# Altium project LiFePO4 Fuel Gauge.PrjPcb
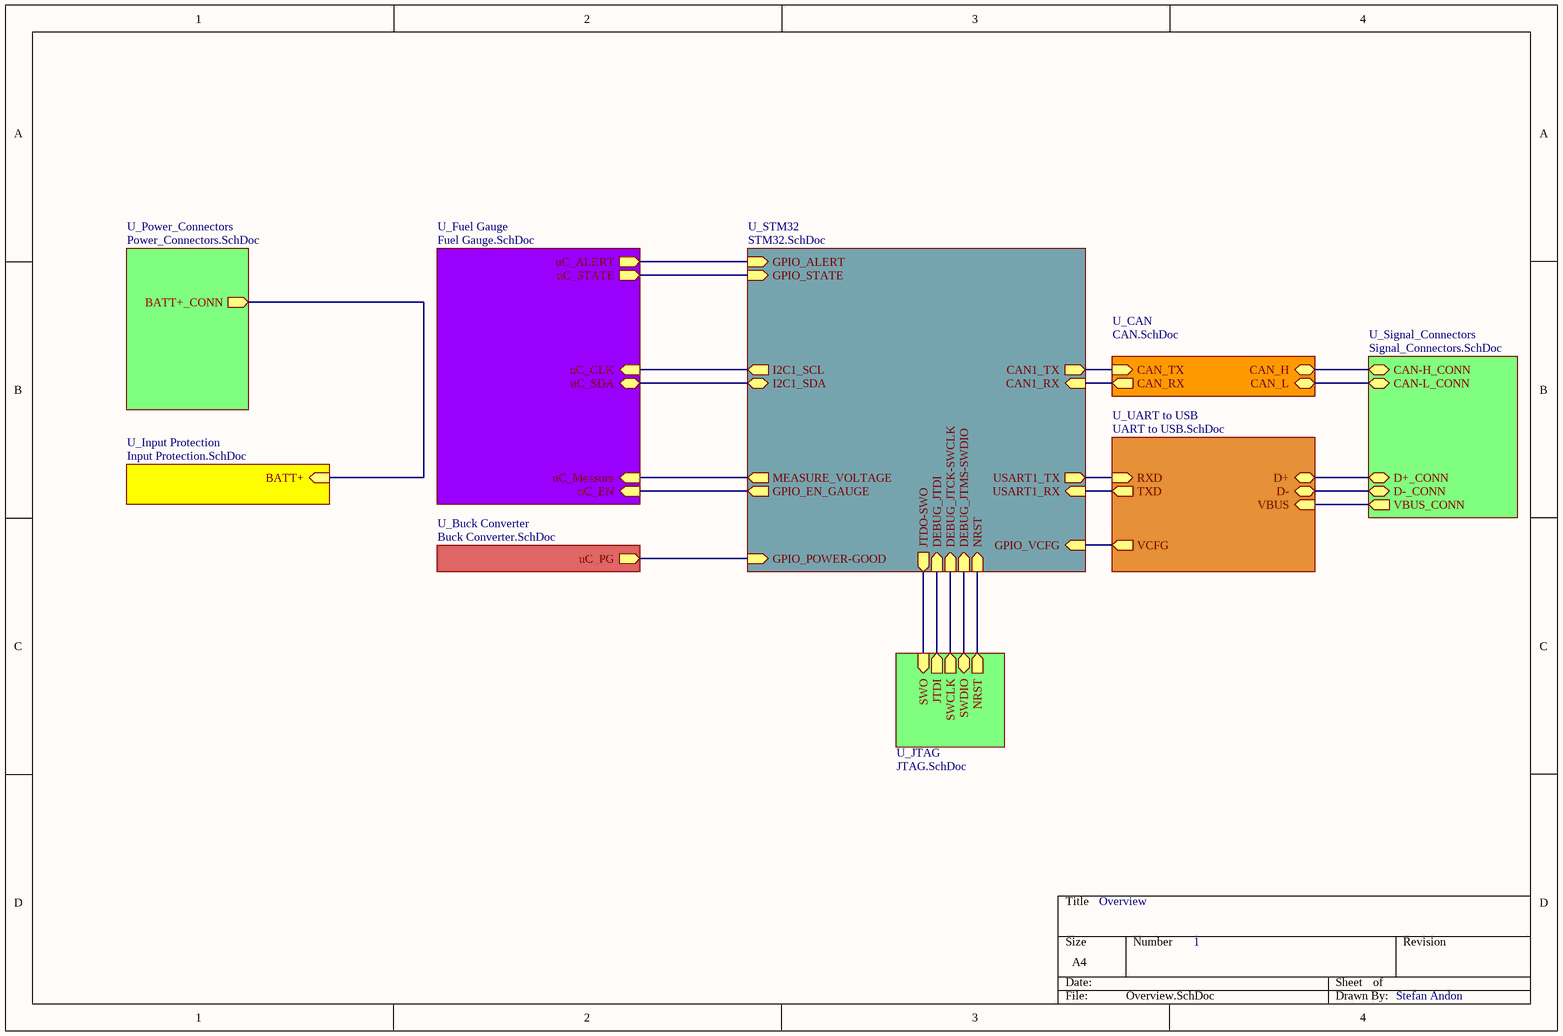
[diagram p0: Overview.SchDoc]
10 sheets, 119 parts. Net scope: hierarchical (ports join the sheet entries above them; power ports are global).
Board file: LiFePO4 Fuel Gauge.PcbDoc
Sheets:
  Overview.SchDoc
    U_Fuel Gauge = Fuel Gauge.SchDoc
    U_Buck Converter = Buck Converter.SchDoc
    U_Input Protection = Input Protection.SchDoc
    U_STM32 = STM32.SchDoc
    U_CAN = CAN.SchDoc
    U_UART to USB = UART to USB.SchDoc
    U_JTAG = JTAG.SchDoc
    U_Power_Connectors = Power_Connectors.SchDoc
    U_Signal_Connectors = Signal_Connectors.SchDoc

## Sheet Overview.SchDoc
size A4; SheetNumber: 1; SheetTotal: 10

### Sub-sheets
U_Buck Converter = Buck Converter.SchDoc: uC_PG (out)
U_CAN = CAN.SchDoc: CAN_TX (in), CAN_RX (out), CAN_H (bidir), CAN_L (bidir)
U_Fuel Gauge = Fuel Gauge.SchDoc: uC_ALERT (out), uC_STATE (out), uC_EN (in), uC_Measure (in), uC_SDA (bidir), uC_CLK (in)
U_Input Protection = Input Protection.SchDoc: BATT+ (in)
U_JTAG = JTAG.SchDoc: SWDIO (bidir), SWCLK (out), SWO (in), JTDI (out), NRST (out)
U_Power_Connectors = Power_Connectors.SchDoc: BATT+_CONN (out)
U_Signal_Connectors = Signal_Connectors.SchDoc: CAN-H_CONN (bidir), CAN-L_CONN (bidir), VBUS_CONN (out), D+_CONN (bidir), D-_CONN (bidir)
U_STM32 = STM32.SchDoc: I2C1_SDA (bidir), I2C1_SCL (out), CAN1_RX (in), CAN1_TX (out), JTDO-SWO (out), DEBUG_JTDI (in), DEBUG_JTCK-SWCLK (in), DEBUG_JTMS-SWDIO (in), NRST (in), USART1_RX (in), USART1_TX (out), GPIO_ALERT (in), GPIO_STATE (in), GPIO_EN_GAUGE (out), MEASURE_VOLTAGE (out), GPIO_POWER-GOOD (in), GPIO_VCFG (in)
U_UART to USB = UART to USB.SchDoc: D+ (bidir), D- (bidir), VCFG (out), TXD (out), RXD (in), VBUS (in)

### Nets
ALERT: sheet U_Fuel Gauge/uC_ALERT, sheet U_STM32/GPIO_ALERT
CAN-H: sheet U_CAN/CAN_H, sheet U_Signal_Connectors/CAN-H_CONN
CAN-L: sheet U_CAN/CAN_L, sheet U_Signal_Connectors/CAN-L_CONN
D+: sheet U_UART to USB/D+, sheet U_Signal_Connectors/D+_CONN
D-: sheet U_UART to USB/D-, sheet U_Signal_Connectors/D-_CONN
PG1: sheet U_Buck Converter/uC_PG, sheet U_STM32/GPIO_POWER-GOOD
STATE: sheet U_Fuel Gauge/uC_STATE, sheet U_STM32/GPIO_STATE
VIN: sheet U_Input Protection/BATT+, sheet U_Power_Connectors/BATT+_CONN
NetC30_1: sheet U_STM32/NRST, sheet U_JTAG/NRST
NetIC1_1: sheet U_Fuel Gauge/uC_EN, sheet U_STM32/GPIO_EN_GAUGE
NetIC1_3: sheet U_Fuel Gauge/uC_Measure, sheet U_STM32/MEASURE_VOLTAGE
NetIC6_26: sheet U_STM32/GPIO_VCFG, sheet U_UART to USB/VCFG
NetIC7_1: sheet U_STM32/CAN1_TX, sheet U_CAN/CAN_TX
NetIC7_4: sheet U_STM32/CAN1_RX, sheet U_CAN/CAN_RX
NetIC9_30: sheet U_Fuel Gauge/uC_CLK, sheet U_STM32/I2C1_SCL
NetIC9_31: sheet U_Fuel Gauge/uC_SDA, sheet U_STM32/I2C1_SDA
NetIC9_34: sheet U_STM32/DEBUG_JTMS-SWDIO, sheet U_JTAG/SWDIO
NetIC9_37: sheet U_STM32/DEBUG_JTCK-SWCLK, sheet U_JTAG/SWCLK
NetIC9_38: sheet U_STM32/DEBUG_JTDI, sheet U_JTAG/JTDI
NetIC9_39: sheet U_STM32/JTDO-SWO, sheet U_JTAG/SWO
NetIC9_42: sheet U_STM32/USART1_TX, sheet U_UART to USB/RXD
NetIC9_43: sheet U_STM32/USART1_RX, sheet U_UART to USB/TXD
NetJ6_A4: sheet U_UART to USB/VBUS, sheet U_Signal_Connectors/VBUS_CONN

### Notes on the sheet
- Overview
- 1
- Stefan Andon

## Sheet Fuel Gauge.SchDoc
size A4; SheetNumber: 7; SheetTotal: 10
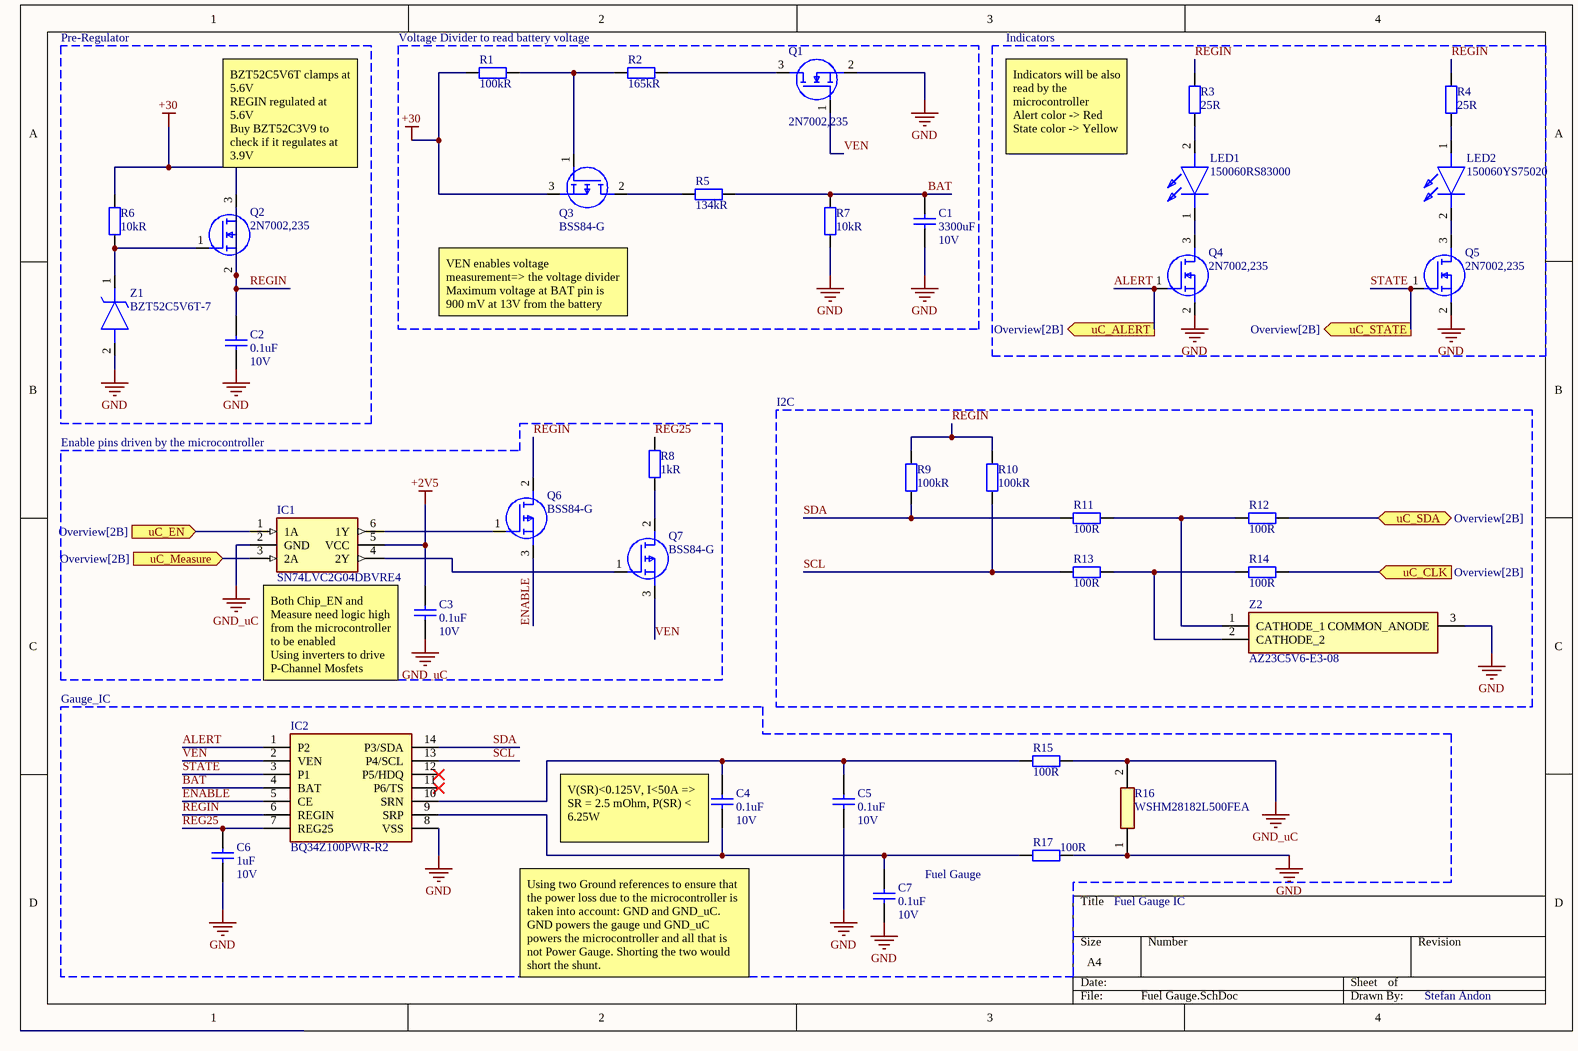
[diagram p1: Fuel Gauge.SchDoc]

### Parts
C1  value 3300uF  Voltage: 10V  [CAP_0603]  (hidden comment: Capacitor_SMD)
C2  value 0.1uF  Voltage: 10V  [CAP_0603]  (hidden comment: Capacitor_SMD)
C3  value 0.1uF  Voltage: 10V  [CAP_0603]  (hidden comment: Capacitor_SMD)
C4  value 0.1uF  Voltage: 10V  [CAP_0603]  (hidden comment: Capacitor_SMD)
C5  value 0.1uF  Voltage: 10V  [CAP_0603]  (hidden comment: Capacitor_SMD)
C6  value 1uF  Voltage: 10V  [CAP_0603]  (hidden comment: Capacitor_SMD)
C7  value 0.1uF  Voltage: 10V  [CAP_0603]  (hidden comment: Capacitor_SMD)
IC1  SN74LVC2G04DBVRE4  [SOT95P280X145-6N]
IC2  BQ34Z100PWR-R2  [SOP65P640X120-14N]
LED1  150060RS83000  [LEDC1608X115N]
LED2  150060YS75020  [150060YS75020]
Q1  2N7002,235  [SOT95P230X110-3N]
Q2  2N7002,235  [SOT95P230X110-3N]
Q3  BSS84-G  [SOT95P240X120-3N]
Q4  2N7002,235  [SOT95P230X110-3N]
Q5  2N7002,235  [SOT95P230X110-3N]
Q6  BSS84-G  [SOT95P240X120-3N]
Q7  BSS84-G  [SOT95P240X120-3N]
R1  value 100kR  [RES_0603]  (hidden comment: Resistor_SMD)
R2  value 165kR  [RES_0603]  (hidden comment: Resistor_SMD)
R3  value 25R  [RES_0603]  (hidden comment: Resistor_SMD)
R4  value 25R  [RES_0603]  (hidden comment: Resistor_SMD)
R5  value 134kR  [RES_0603]  (hidden comment: Resistor_SMD)
R6  value 10kR  [RES_0603]  (hidden comment: Resistor_SMD)
R7  value 10kR  [RES_0603]  (hidden comment: Resistor_SMD)
R8  value 1kR  [RES_0603]  (hidden comment: Resistor_SMD)
R9  value 100kR  [RES_0603]  (hidden comment: Resistor_SMD)
R10  value 100kR  [RES_0603]  (hidden comment: Resistor_SMD)
R11  value 100R  [RES_0603]  (hidden comment: Resistor_SMD)
R12  value 100R  [RES_0603]  (hidden comment: Resistor_SMD)
R13  value 100R  [RES_0603]  (hidden comment: Resistor_SMD)
R14  value 100R  [RES_0603]  (hidden comment: Resistor_SMD)
R15  value 100R  [RES_0603]  (hidden comment: Resistor_SMD)
R16  WSHM28182L500FEA  [WSHM28182L500FEA]
R17  value 100R  [RES_0603]  (hidden comment: Resistor_SMD)
Z1  BZT52C5V6T-7  [BZT52C5V6T7]
Z2  AZ23C5V6-E3-08  [SOT95P248X115-3N]

### Blocks framed on the sheet
Pre-Regulator: C2 Q2 R6 Z1
Voltage Divider to read battery voltage: C1 Q1 Q3 R1 R2 R5 R7
Indicators: LED1 LED2 Q4 Q5 R3 R4
I2C: R9-R14 Z2

### Ports
uC_ALERT (out, see Overview[2B]), uC_CLK (in, see Overview[2B]), uC_EN (in, see Overview[2B]), uC_Measure (in, see Overview[2B]), uC_SDA (bidir, see Overview[2B]), uC_STATE (out, see Overview[2B])

### Nets
+2V5: C3.2 IC1.5(VCC)
+30: Q2.3(D) Q3.3(S) R1.1 R6.1
GND: C1.1 C2.1 C5.1 C6.1 C7.1 IC2.8(VSS) Q1.2(S) Q4.2(S) Q5.2(S) R7.1 R16.1 R17.1 Z1.2(A) Z2.3(COMMON_ANODE)
GND_uC: C3.1 IC1.2(GND) R15.1 R16.2
ALERT: IC2.1(P2) Q4.1(G) ; port uC_ALERT
BAT: C1.2 IC2.4(BAT) R5.2 R7.2
ENABLE: IC2.5(CE) Q6.3(S)
REG25: C6.2 IC2.7(REG25) R8.2
REGIN: C2.2 IC2.6(REGIN) Q2.2(S) Q6.2(D) R3.2 R4.2 R9.2 R10.2
SCL: IC2.13(P4/SCL) R10.1 R13.2
SDA: IC2.14(P3/SDA) R9.1 R11.2
STATE: IC2.3(P1) Q5.1(G) ; port uC_STATE
VEN: IC2.2(VEN) Q1.1(G) Q7.3(S)
NetC4_1: C4.1 C7.2 IC2.9(SRP) R17.2
NetC4_2: C4.2 C5.2 IC2.10(SRN) R15.2
NetIC1_1: IC1.1(1A) ; port uC_EN
NetIC1_3: IC1.3(2A) ; port uC_Measure
NetIC1_4: IC1.4(2Y) Q7.1(G)
NetIC1_6: IC1.6(1Y) Q6.1(G)
NetIC9_30: R14.1 ; port uC_CLK
NetIC9_31: R12.1 ; port uC_SDA
NetLED1_1: LED1.1(K) Q4.3(D)
NetLED1_2: LED1.2(A) R3.1
NetLED2_1: LED2.1(A) R4.1
NetLED2_2: LED2.2(K) Q5.3(D)
NetQ1_3: Q1.3(D) R2.2
NetQ2_1: Q2.1(G) R6.2 Z1.1(K)
NetQ3_1: Q3.1(G) R1.2 R2.1
NetQ3_2: Q3.2(D) R5.1
NetQ7_2: Q7.2(D) R8.1
NetR11_1: R11.1 R12.2 Z2.1(CATHODE_1)
NetR13_1: R13.1 R14.2 Z2.2(CATHODE_2)

Not connected (* = marked no-connect by the designer): IC2 11(P6/TS)* 12(P5/HDQ)*

### Notes on the sheet
- (near Q2) BZT52C5V6T clamps at 5.6V
  REGIN regulated at 5.6V
  Buy BZT52C3V9 to check if it regulates at 3.9V
- Indicators will be also read by the microcontroller
  Alert color -> Red
  State color -> Yellow
- VEN enables voltage measurement=> the voltage divider
  Maximum voltage at BAT pin is 900 mV at 13V from the battery
- Enable pins driven by the microcontroller
- Gauge_IC
- Both Chip_EN and Measure need logic high from the microcontroller to be enabled
  Using inverters to drive P-Channel Mosfets
- (near C4) V(SR)<0.125V, I<50A => SR = 2.5 mOhm, P(SR) < 6.25W
- Fuel Gauge
- Fuel Gauge IC
- Using two Ground references to ensure that the power loss due to the microcontroller is taken into account: GND and GND_uC. GND powers the gauge und GND_uC powers the microcontroller and all that is not Power Gauge. Shorting the two would short the shunt.
- Stefan Andon

### Library data of the parts
C1 = CMP-001-0004-13: SMD Capacitor; Tolerance: tbd; BOM: 3300uF, 10V, tbd, tbd,CAP_0603; Dielectric: tbd; Package: tbd
C2-C5 C7 = CMP-001-0004-13: SMD Capacitor; Tolerance: tbd; BOM: 0.1uF, 10V, tbd, tbd,CAP_0603; Dielectric: tbd; Package: tbd
C6 = CMP-001-0004-13: SMD Capacitor; Tolerance: tbd; BOM: 1uF, 10V, tbd, tbd,CAP_0603; Dielectric: tbd; Package: tbd
IC1 = SN74LVC2G04DBVRE4: Integrated Circuit; Manufacturer_Name: Texas Instruments; Datasheet Link: https://www.arrow.com/en/products/sn74lvc2g04dbvre4/texas-instruments; Height: 1.45mm; Manufacturer_Part_Number: SN74LVC2G04DBVRE4; Mouser Part Number: 595-SN74LVC2G04DBVRE; Mouser Price/Stock: https://www.mouser.co.uk/ProductDetail/Texas-Instruments/SN74LVC2G04DBVRE4?qs=PVVDbbWpW3Jcz3iqyBLxqA%3D%3D; Arrow Part Number: SN74LVC2G04DBVRE4; Arrow Price/Stock: https://www.arrow.com/en/products/sn74lvc2g04dbvre4/texas-instruments?utm_currency=USD&region=nac
IC2 = BQ34Z100PWR-R2: Integrated Circuit; Manufacturer_Name: Texas Instruments; Datasheet Link: https://www.arrow.com/en/products/bq34z100pwr-r2/texas-instruments?region=nac; Height: 1.2mm; Manufacturer_Part_Number: BQ34Z100PWR-R2; Mouser Part Number: 595-BQ34Z100PWR-R2; Mouser Price/Stock: https://www.mouser.co.uk/ProductDetail/Texas-Instruments/BQ34Z100PWR-R2?qs=rQFj71Wb1eWspkgmxcmVcA%3D%3D; Arrow Part Number: BQ34Z100PWR-R2; Arrow Price/Stock: https://www.arrow.com/en/products/bq34z100pwr-r2/texas-instruments?utm_currency=USD&region=nac
LED1 = 150060RS83000: LED; Manufacturer_Name: Wurth Elektronik; Datasheet Link: https://www.mouser.com/datasheet/2/445/150060RS86000-1838740.pdf; Height: 1.15mm; Manufacturer_Part_Number: 150060RS83000
LED2 = 150060YS75020: LED; Manufacturer_Name: Wurth Elektronik; Datasheet Link: https://componentsearchengine.com/Datasheets/2/150060YS75020.pdf; Height: 0.45mm; Manufacturer_Part_Number: 150060YS75020; Mouser Part Number: 710-150060YS75020; Mouser Price/Stock: https://www.mouser.co.uk/ProductDetail/Wurth-Elektronik/150060YS75020?qs=d0WKAl%252BL4KaB8TvTwBNhow%3D%3D
Q1 Q2 Q4 Q5 = 2N7002,235: MOSFET (N-Channel); Manufacturer_Name: Nexperia; Datasheet Link: https://assets.nexperia.com/documents/data-sheet/2N7002.pdf; Height: 1.1mm; Manufacturer_Part_Number: 2N7002,235; Mouser Part Number: 771-2N7002235; Mouser Price/Stock: https://www.mouser.co.uk/ProductDetail/Nexperia/2N7002235?qs=AX3SRYwdf7Gv59FeQZ%2FkYw%3D%3D; Arrow Part Number: 2N7002,235; Arrow Price/Stock: https://www.arrow.com/en/products/2n7002235/nexperia?utm_currency=USD&region=europe
Q3 Q6 Q7 = BSS84-G: MOSFET (P-Channel); Manufacturer_Name: onsemi; Datasheet Link: https://componentsearchengine.com/Datasheets/1/BSS84-G.pdf; Height: 1.2mm; Manufacturer_Part_Number: BSS84-G; Mouser Part Number: 863-BSS84-G; Mouser Price/Stock: https://www.mouser.co.uk/ProductDetail/onsemi/BSS84-G?qs=UkDUCjYnTB2fT1WGeui6RQ%3D%3D
R1-R15 R17 = CMP-001-0003-18: Tolerance: tbd; Power: 7W; BOM: Value+', '+Power+', '+Tolerance+', '+CurrentFootprint; Package: tbd
R16 = WSHM28182L500FEA: Resistor; Manufacturer_Name: Vishay; Datasheet Link: https://www.vishay.com/doc?30188; Height: 1.75mm; Manufacturer_Part_Number: WSHM28182L500FEA; Mouser Part Number: 71-WSHM28182L500FEA; Mouser Price/Stock: https://www.mouser.co.uk/ProductDetail/Vishay-Dale/WSHM28182L500FEA?qs=Blj4iBE%2FJuPIwDroY2n%2Fgg%3D%3D
Z1 = BZT52C5V6T-7: Zener Diode; Manufacturer_Name: Diodes Incorporated; Datasheet Link: https://www.diodes.com/datasheet/download/BZT52CxxT.pdf; Height: 0.65mm; Manufacturer_Part_Number: BZT52C5V6T-7; Mouser Part Number: 621-BZT52C5V6T-7; Mouser Price/Stock: https://www.mouser.co.uk/ProductDetail/Diodes-Incorporated/BZT52C5V6T-7?qs=zLeapIUCO8Tm%252BIuaCPAdkQ%3D%3D; Arrow Part Number: BZT52C5V6T-7; Arrow Price/Stock: https://www.arrow.com/en/products/bzt52c5v6t-7/diodes-incorporated?region=nac
Z2 = AZ23C5V6-E3-08: Zener Diode; Manufacturer_Name: Vishay; Datasheet Link: https://www.vishay.com/docs/85759/az23.pdf; Height: 1.15mm; Manufacturer_Part_Number: AZ23C5V6-E3-08; Mouser Part Number: 78-AZ23C5V6-E3-08; Mouser Price/Stock: https://www.mouser.co.uk/ProductDetail/Vishay-Semiconductors/AZ23C5V6-E3-08?qs=KP8Io%2FXyE5TgneZJwqz1XQ%3D%3D; Arrow Part Number: AZ23C5V6-E3-08; Arrow Price/Stock: https://www.arrow.com/en/products/az23c5v6-e3-08/vishay?utm_currency=USD&region=nac

## Sheet Buck Converter.SchDoc
size A4; SheetNumber: 8; SheetTotal: 10
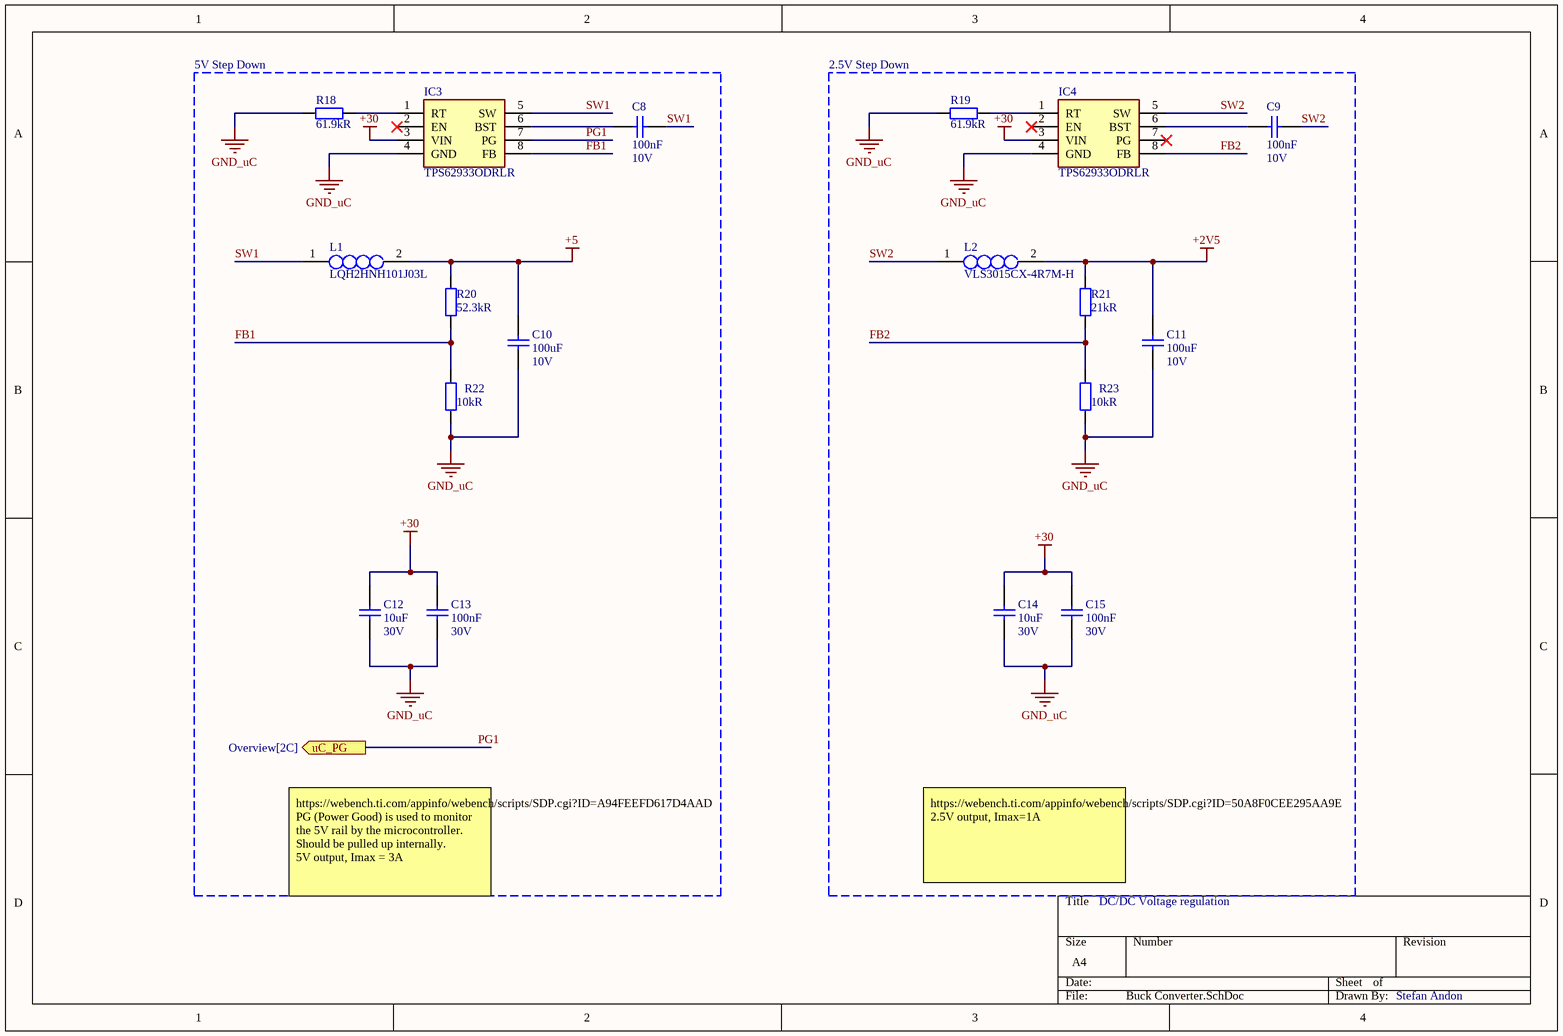
[diagram p2: Buck Converter.SchDoc]

### Parts
C8  value 100nF  Voltage: 10V  [CAP_0603]  (hidden comment: Capacitor_SMD)
C9  value 100nF  Voltage: 10V  [CAP_0603]  (hidden comment: Capacitor_SMD)
C10  value 100uF  Voltage: 10V  [CAP_0603]  (hidden comment: Capacitor_SMD)
C11  value 100uF  Voltage: 10V  [CAP_0603]  (hidden comment: Capacitor_SMD)
C12  value 10uF  Voltage: 30V  [CAP_0603]  (hidden comment: Capacitor_SMD)
C13  value 100nF  Voltage: 30V  [CAP_0603]  (hidden comment: Capacitor_SMD)
C14  value 10uF  Voltage: 30V  [CAP_0603]  (hidden comment: Capacitor_SMD)
C15  value 100nF  Voltage: 30V  [CAP_0603]  (hidden comment: Capacitor_SMD)
IC3  TPS62933ODRLR  [SOTFL50P160X60-8N]
IC4  TPS62933ODRLR  [SOTFL50P160X60-8N]
L1  LQH2HNH101J03L  [LQH2HNH100J03L]
L2  VLS3015CX-4R7M-H  [VLS3015]
R18  value 61.9kR  [RES_0603]  (hidden comment: Resistor_SMD)
R19  value 61.9kR  [RES_0603]  (hidden comment: Resistor_SMD)
R20  value 52.3kR  [RES_0603]  (hidden comment: Resistor_SMD)
R21  value 21kR  [RES_0603]  (hidden comment: Resistor_SMD)
R22  value 10kR  [RES_0603]  (hidden comment: Resistor_SMD)
R23  value 10kR  [RES_0603]  (hidden comment: Resistor_SMD)

### Blocks framed on the sheet
5V Step Down: C8 C10 C12 C13 IC3 L1 R18 R20 R22
2.5V Step Down: C9 C11 C14 C15 IC4 L2 R19 R21 R23

### Ports
uC_PG (out, see Overview[2C])

### Nets
+2V5: C11.2 L2.2 R21.1
+5: C10.2 L1.2 R20.1
+30: C12.2 C13.2 C14.2 C15.2 IC3.3(VIN) IC4.3(VIN)
GND_uC: C10.1 C11.1 C12.1 C13.1 C14.1 C15.1 IC3.4(GND) IC4.4(GND) R18.1 R19.1 R22.2 R23.2
FB1: IC3.8(FB) R20.2 R22.1
FB2: IC4.8(FB) R21.2 R23.1
PG1: IC3.7(PG) ; port uC_PG
SW1: C8.1 IC3.5(SW) L1.1
SW2: C9.1 IC4.5(SW) L2.1
NetC8_2: C8.2 IC3.6(BST)
NetC9_2: C9.2 IC4.6(BST)
NetIC3_1: IC3.1(RT) R18.2
NetIC4_1: IC4.1(RT) R19.2

Not connected (* = marked no-connect by the designer): IC3 2(EN)*; IC4 2(EN)* 7(PG)*

### Notes on the sheet
- https://webench.ti.com/appinfo/webench/scripts/SDP.cgi?ID=A94FEEFD617D4AAD
  PG (Power Good) is used to monitor the 5V rail by the microcontroller. Should be pulled up internally.
  5V output, Imax = 3A
- https://webench.ti.com/appinfo/webench/scripts/SDP.cgi?ID=50A8F0CEE295AA9E
  2.5V output, Imax=1A
- DC/DC Voltage regulation
- Stefan Andon

### Library data of the parts
C8 C9 = CMP-001-0004-13: SMD Capacitor; Tolerance: tbd; BOM: 100nF, 10V, tbd, tbd,CAP_0603; Dielectric: tbd; Package: tbd
C10 C11 = CMP-001-0004-13: SMD Capacitor; Tolerance: tbd; BOM: 100uF, 10V, tbd, tbd,CAP_0603; Dielectric: tbd; Package: tbd
C12 C14 = CMP-001-0004-13: SMD Capacitor; Tolerance: tbd; BOM: 10uF, 30V, tbd, tbd,CAP_0603; Dielectric: tbd; Package: tbd
C13 C15 = CMP-001-0004-13: SMD Capacitor; Tolerance: tbd; BOM: 100nF, 30V, tbd, tbd,CAP_0603; Dielectric: tbd; Package: tbd
IC3 IC4 = TPS62933ODRLR: Integrated Circuit; Manufacturer_Name: Texas Instruments; Datasheet Link: https://www.ti.com/lit/ds/symlink/tps62933o.pdf?ts=1692352588671&ref_url=https%253A%252F%252Fwww.ti.com%252Fproduct%252FTPS62933O%252Fpart-details%252FTPS62933ODRLR; Height: 0.6mm; Manufacturer_Part_Number: TPS62933ODRLR; Mouser Part Number: 595-TPS62933ODRLR; Mouser Price/Stock: https://www.mouser.co.uk/ProductDetail/Texas-Instruments/TPS62933ODRLR?qs=By6Nw2ByBD3VuSv7z7GudQ%3D%3D; Arrow Part Number: TPS62933ODRLR; Arrow Price/Stock: https://www.arrow.com/en/products/tps62933odrlr/texas-instruments?utm_currency=USD&region=nac
L1 = LQH2HNH101J03L: Inductor; Manufacturer_Name: Murata Electronics; Datasheet Link: https://search.murata.co.jp/Ceramy/image/img/P02/JELF243A-9157.pdf; Height: 1mm; Manufacturer_Part_Number: LQH2HNH101J03L; Mouser Part Number: 81-LQH2HNH101J03L; Mouser Price/Stock: https://www.mouser.co.uk/ProductDetail/Murata-Electronics/LQH2HNH101J03L?qs=t7xnP681wgVMHYq5XfcGGA%3D%3D
L2 = VLS3015CX-4R7M-H: Inductor; Manufacturer_Name: TDK; Datasheet Link: https://product.tdk.com/system/files/dam/doc/product/inductor/inductor/smd/catalog/inductor_automotive_power_vls3015cx-h_en.pdf; Manufacturer_Part_Number: VLS3015CX-4R7M-H; Mouser Part Number: 810-VLS3015CX-4R7M-H; Mouser Price/Stock: https://www.mouser.co.uk/ProductDetail/TDK/VLS3015CX-4R7M-H?qs=sPbYRqrBIVlQG%2FoSdSjKkg%3D%3D; Arrow Part Number: VLS3015CX-4R7M-H; Arrow Price/Stock: https://www.arrow.com/en/products/vls3015cx-4r7m-h/tdk?utm_currency=USD&region=nac
R18-R23 = CMP-001-0003-18: as R1 on sheet Fuel Gauge; Package: tbd

## Sheet Input Protection.SchDoc
size A4; SheetNumber: 4; SheetTotal: 10
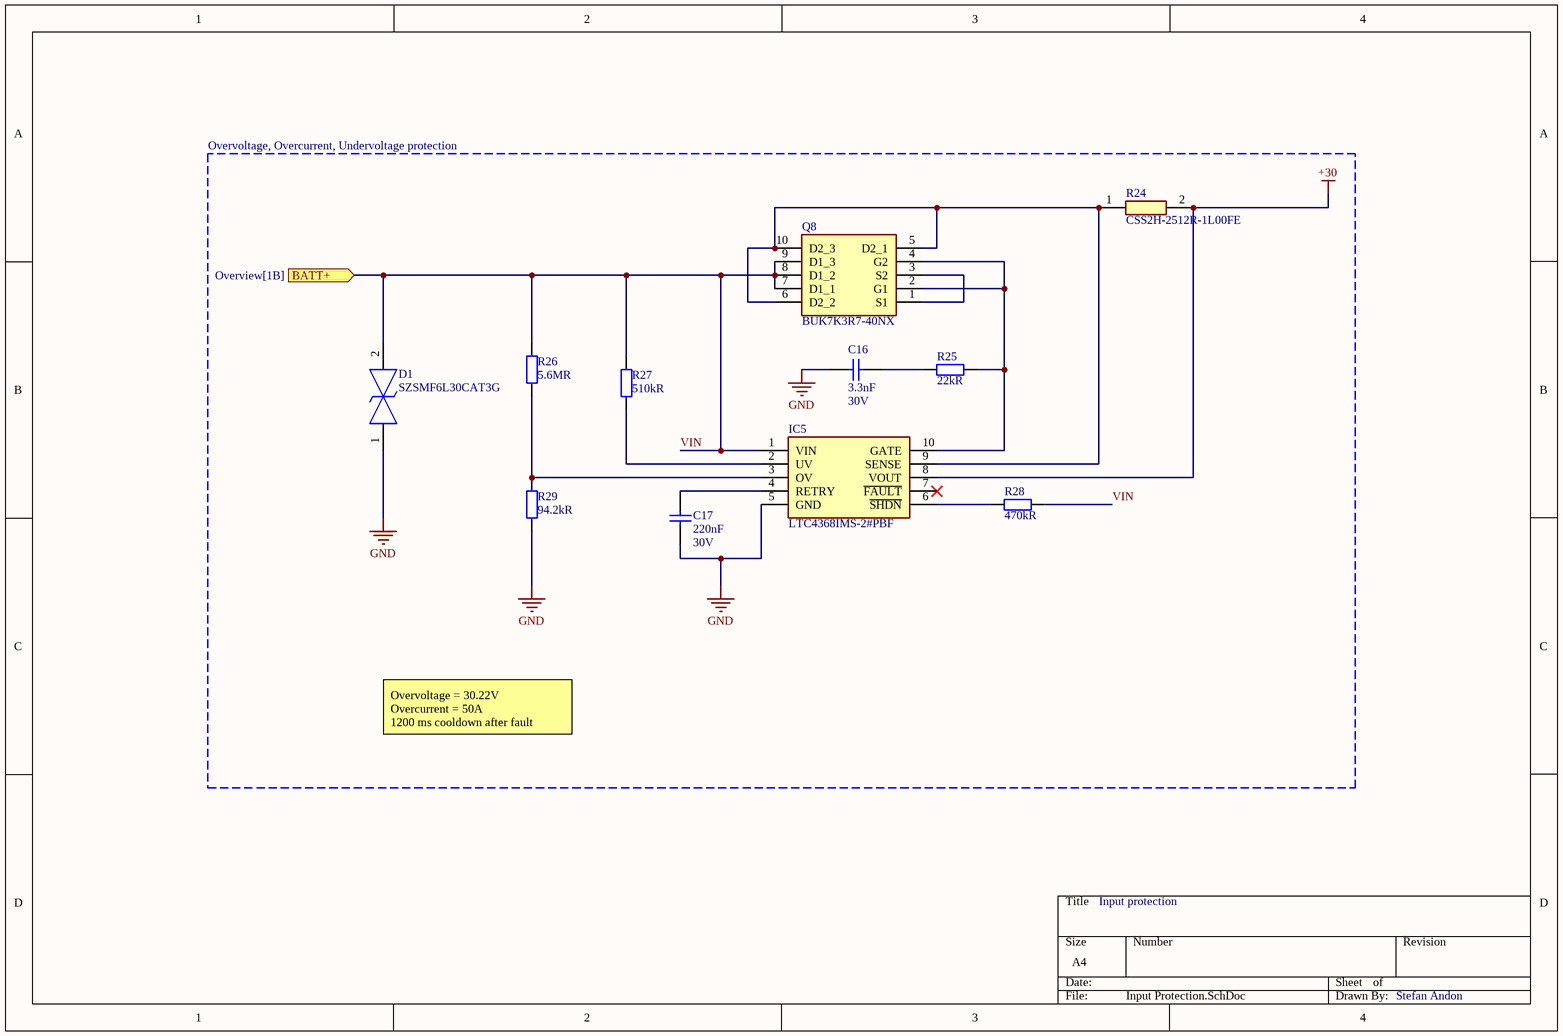
[diagram p3: Input Protection.SchDoc]

### Parts
C16  value 3.3nF  Voltage: 30V  [CAP_0603]  (hidden comment: Capacitor_SMD)
C17  value 220nF  Voltage: 30V  [CAP_0603]  (hidden comment: Capacitor_SMD)
D1  SZSMF6L30CAT3G  [SMFA2005CA]
IC5  LTC4368IMS-2#PBF  [SOP50P490X110-10N]
Q8  BUK7K3R7-40NX  [BUK7K29100EX]
R24  CSS2H-2512R-1L00FE  [CSS2H2512R1L00FE]
R25  value 22kR  [RES_0603]  (hidden comment: Resistor_SMD)
R26  value 5.6MR  [RES_0603]  (hidden comment: Resistor_SMD)
R27  value 510kR  [RES_0603]  (hidden comment: Resistor_SMD)
R28  value 470kR  [RES_0603]  (hidden comment: Resistor_SMD)
R29  value 94.2kR  [RES_0603]  (hidden comment: Resistor_SMD)

### Blocks framed on the sheet
Overvoltage, Overcurrent, Undervoltage protection: C16 C17 D1 IC5 Q8 R24-R29

### Ports
BATT+ (in, see Overview[1B])

### Nets
+30: IC5.8(VOUT) R24.2
GND: C16.2 C17.2 D1.1 IC5.5(GND) R29.1
VIN: D1.2 IC5.1(VIN) Q8.7(D1_1) Q8.8(D1_2) Q8.9(D1_3) R26.2 R27.2 R28.1 ; port BATT+
NetC16_1: C16.1 R25.1
NetC17_1: C17.1 IC5.4(RETRY)
NetIC5_2: IC5.2(UV) R27.1
NetIC5_3: IC5.3(OV) R26.1 R29.2
NetIC5_6: IC5.6(~{SHDN}) R28.2
NetIC5_9: IC5.9(SENSE) Q8.5(D2_1) Q8.6(D2_2) Q8.10(D2_3) R24.1
NetIC5_10: IC5.10(GATE) Q8.2(G1) Q8.4(G2) R25.2
NetQ8_1: Q8.1(S1) Q8.3(S2)

Not connected (* = marked no-connect by the designer): IC5 7(~{FAULT})*

### Notes on the sheet
- Overvoltage = 30.22V
  Overcurrent = 50A
  1200 ms cooldown after fault
- Input protection
- Stefan Andon

### Library data of the parts
C16 = CMP-001-0004-13: SMD Capacitor; Tolerance: tbd; BOM: 3.3nF, 30V, tbd, tbd,CAP_0603; Dielectric: tbd; Package: tbd
C17 = CMP-001-0004-13: SMD Capacitor; Tolerance: tbd; BOM: 220nF, 30V, tbd, tbd,CAP_0603; Dielectric: tbd; Package: tbd
D1 = SZSMF6L30CAT3G: TVS Diode (Bi-directional); Manufacturer_Name: LITTELFUSE; Datasheet Link: https://cdn1-originals.webdamdb.com/14154_163817421?cache=1753841810&response-content-disposition=inline;filename=TVS_Diode_SZSMF6L_2025-5-16.pdf&response-content-type=application/pdf&Policy=eyJTdGF0ZW1lbnQiOlt7IlJlc291cmNlIjoiaHR0cCo6Ly9jZG4xLW9yaWdpbmFs; Height: 1.08mm; Manufacturer_Part_Number: SZSMF6L30CAT3G
IC5 = LTC4368IMS-2#PBF: Integrated Circuit; Manufacturer_Name: Analog Devices; Datasheet Link: https://www.arrow.com/en/products/ltc4368ims-2pbf/analog-devices; Height: 1.1mm; Manufacturer_Part_Number: LTC4368IMS-2#PBF; Mouser Part Number: 584-LTC4368IMS2PBF; Mouser Price/Stock: https://www.mouser.co.uk/ProductDetail/Analog-Devices/LTC4368IMS-2PBF?qs=5aG0NVq1C4yQGBsRaTKLEg%3D%3D; Arrow Part Number: LTC4368IMS-2#PBF; Arrow Price/Stock: https://www.arrow.com/en/products/ltc4368ims-2pbf/analog-devices?region=nac
Q8 = BUK7K3R7-40NX: MOSFET (N-Channel); Manufacturer_Name: Nexperia; Datasheet Link: https://assets.nexperia.com/documents/data-sheet/BUK7K3R7-40N.pdf; Height: 1.15mm; Manufacturer_Part_Number: BUK7K3R7-40NX
R24 = CSS2H-2512R-1L00FE: Resistor; Manufacturer_Name: Bourns; Datasheet Link: http://www.bourns.com/docs/Product-Datasheets/css2h-2512.pdf; Height: 0.87mm; Manufacturer_Part_Number: CSS2H-2512R-1L00FE; Mouser Part Number: 652-CSS2H2512R1L00FE; Mouser Price/Stock: https://www.mouser.co.uk/ProductDetail/Bourns/CSS2H-2512R-1L00FE?qs=jDo7WO9B8muVb3lAsH3s1A%3D%3D; Arrow Part Number: CSS2H-2512R-1L00FE; Arrow Price/Stock: https://www.arrow.com/en/products/css2h-2512r-1l00fe/bourns?utm_currency=USD&region=nac
R25-R29 = CMP-001-0003-18: as R1 on sheet Fuel Gauge; Package: tbd

## Sheet STM32.SchDoc
size A4; SheetNumber: 6; SheetTotal: 10
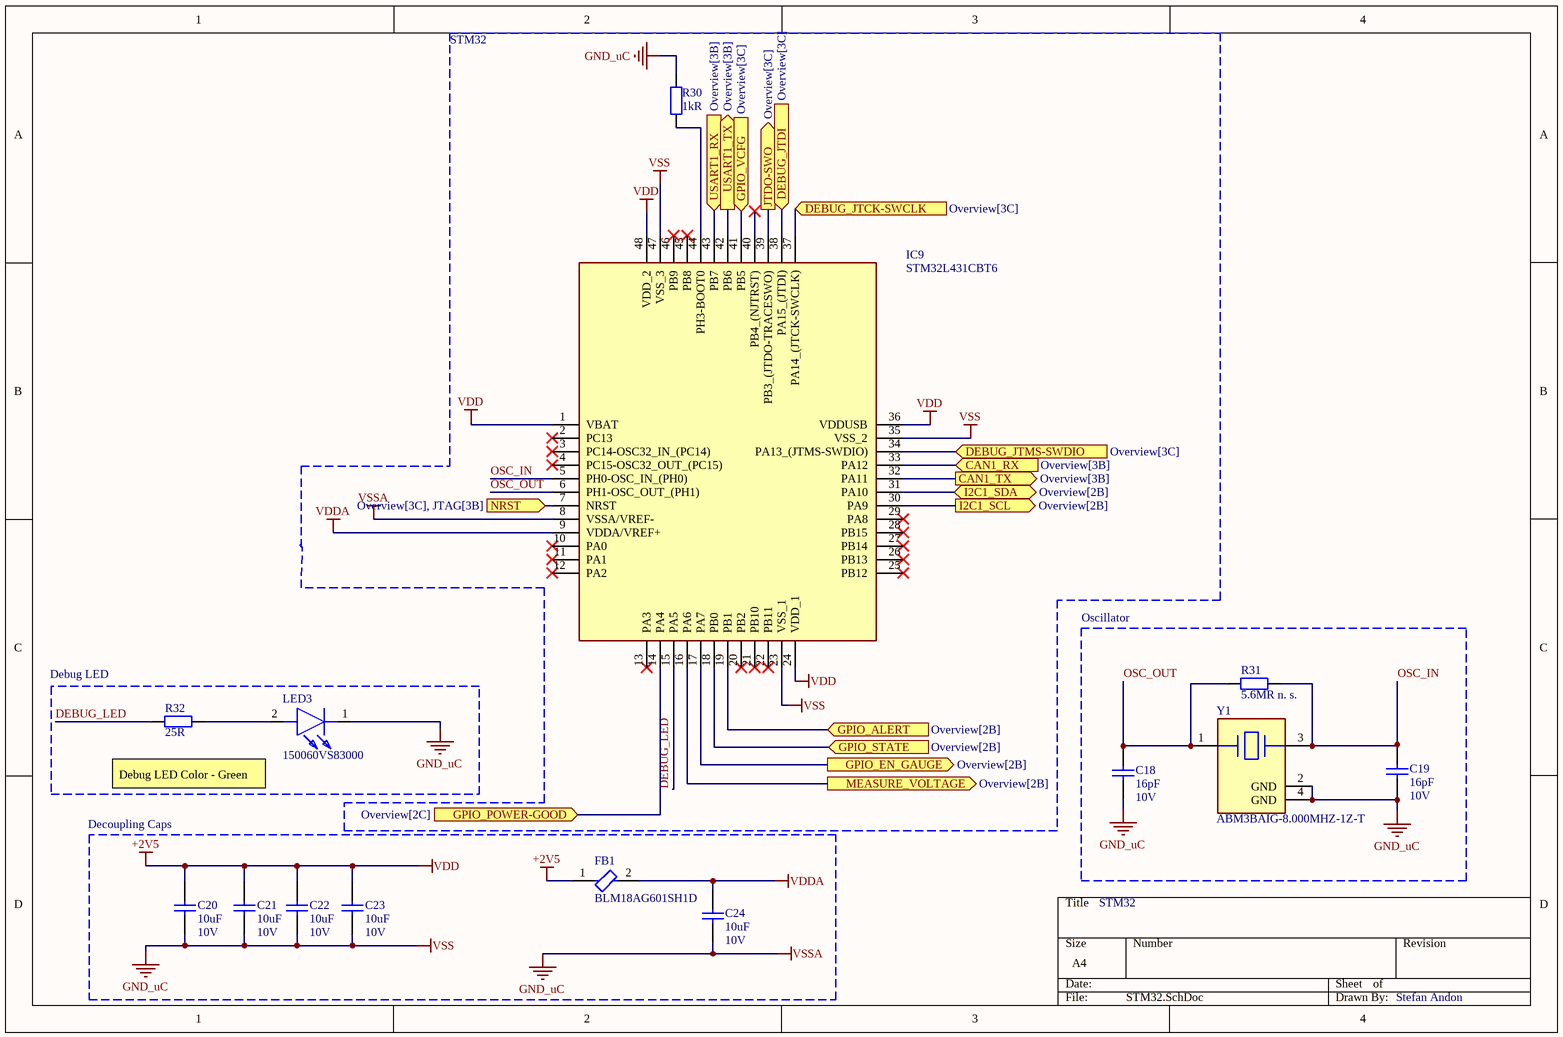
[diagram p4: STM32.SchDoc]

### Parts
C18  value 16pF  Voltage: 10V  [CAP_0603]  (hidden comment: Capacitor_SMD)
C19  value 16pF  Voltage: 10V  [CAP_0603]  (hidden comment: Capacitor_SMD)
C20  value 10uF  Voltage: 10V  [CAP_0603]  (hidden comment: Capacitor_SMD)
C21  value 10uF  Voltage: 10V  [CAP_0603]  (hidden comment: Capacitor_SMD)
C22  value 10uF  Voltage: 10V  [CAP_0603]  (hidden comment: Capacitor_SMD)
C23  value 10uF  Voltage: 10V  [CAP_0603]  (hidden comment: Capacitor_SMD)
C24  value 10uF  Voltage: 10V  [CAP_0603]  (hidden comment: Capacitor_SMD)
FB1  BLM18AG601SH1D  [FP-BLM18-0_15-t0_8-MFG]
IC9  STM32L431CBT6  [QFP50P900X900X160-48N]
LED3  150060VS83000  [150060VS83000]
R30  value 1kR  [RES_0603]  (hidden comment: Resistor_SMD)
R31  value 5.6MR n. s.  [RES_0603]  (hidden comment: Resistor_SMD)
R32  value 25R  [RES_0603]  (hidden comment: Resistor_SMD)
Y1  ABM3BAIG-8.000MHZ-1Z-T  [FP-ABM3BAIG-MFG]

### Blocks framed on the sheet
Oscillator: C18 C19 R31 Y1
Debug LED: LED3 R32
Decoupling Caps: C20-C24 FB1

### Ports
CAN1_RX (in, see Overview[3B]), CAN1_TX (out, see Overview[3B]), DEBUG_JTCK-SWCLK (in, see Overview[3C]), DEBUG_JTDI (in, see Overview[3C]), DEBUG_JTMS-SWDIO (in, see Overview[3C]), GPIO_ALERT (in, see Overview[2B]), GPIO_EN_GAUGE (out, see Overview[2B]), GPIO_POWER-GOOD (in, see Overview[2C]), GPIO_STATE (in, see Overview[2B]), GPIO_VCFG (in, see Overview[3C]), I2C1_SCL (out, see Overview[2B]), I2C1_SDA (bidir, see Overview[2B]), JTDO-SWO (out, see Overview[3C]), MEASURE_VOLTAGE (out, see Overview[2B]), NRST (in, see Overview[3C], JTAG[3B]), USART1_RX (in, see Overview[3B]), USART1_TX (out, see Overview[3B])

### Nets
+2V5: C20.1 C21.1 C22.1 C23.1 FB1.1 IC9.1(VBAT) IC9.24(VDD_1) IC9.36(VDDUSB) IC9.48(VDD_2)  [also labelled VDD]
GND_uC: C18.2 C19.2 C20.2 C21.2 C22.2 C23.2 C24.2 IC9.8(VSSA/VREF-) IC9.23(VSS_1) IC9.35(VSS_2) IC9.47(VSS_3) LED3.1(K) R30.1 Y1.2(GND) Y1.4(GND)  [also labelled VSS, VSSA]
VDDA: C24.1 FB1.2 IC9.9(VDDA/VREF+)
ALERT: IC9.19(PB1) ; port GPIO_ALERT
DEBUG_LED: IC9.15(PA5) R32.2
OSC_IN: C19.1 IC9.5(PH0-OSC_IN_(PH0)) R31.1 Y1.3
OSC_OUT: C18.1 IC9.6(PH1-OSC_OUT_(PH1)) R31.2 Y1.1
PG1: IC9.14(PA4) ; port GPIO_POWER-GOOD
STATE: IC9.18(PB0) ; port GPIO_STATE
NetC30_1: IC9.7(NRST) ; port NRST
NetIC1_1: IC9.17(PA7) ; port GPIO_EN_GAUGE
NetIC1_3: IC9.16(PA6) ; port MEASURE_VOLTAGE
NetIC6_26: IC9.41(PB5) ; port GPIO_VCFG
NetIC7_1: IC9.32(PA11) ; port CAN1_TX
NetIC7_4: IC9.33(PA12) ; port CAN1_RX
NetIC9_30: IC9.30(PA9) ; port I2C1_SCL
NetIC9_31: IC9.31(PA10) ; port I2C1_SDA
NetIC9_34: IC9.34(PA13_(JTMS-SWDIO)) ; port DEBUG_JTMS-SWDIO
NetIC9_37: IC9.37(PA14_(JTCK-SWCLK)) ; port DEBUG_JTCK-SWCLK
NetIC9_38: IC9.38(PA15_(JTDI)) ; port DEBUG_JTDI
NetIC9_39: IC9.39(PB3_(JTDO-TRACESWO)) ; port JTDO-SWO
NetIC9_42: IC9.42(PB6) ; port USART1_TX
NetIC9_43: IC9.43(PB7) ; port USART1_RX
NetIC9_44: IC9.44(PH3-BOOT0) R30.2
NetLED3_2: LED3.2(A) R32.1

Not connected (* = marked no-connect by the designer): IC9 2(PC13)* 3(PC14-OSC32_IN_(PC14))* 4(PC15-OSC32_OUT_(PC15))* 10(PA0)* 11(PA1)* 12(PA2)* 13(PA3)* 20(PB2)* 21(PB10)* 22(PB11)* 25(PB12)* 26(PB13)* 27(PB14)* 28(PB15)* 29(PA8)* 40(PB4_(NJTRST))* 45(PB8)* 46(PB9)*

### Notes on the sheet
- STM32
- Debug LED Color - Green
- Stefan Andon

### Library data of the parts
C18 C19 = CMP-001-0004-13: SMD Capacitor; Tolerance: tbd; BOM: 16pF, 10V, tbd, tbd,CAP_0603; Dielectric: tbd; Package: tbd
C20-C24 = CMP-001-0004-13: SMD Capacitor; Tolerance: tbd; BOM: 10uF, 10V, tbd, tbd,CAP_0603; Dielectric: tbd; Package: tbd
FB1 = CMP-2000-05953-2: Chip Ferrite Bead, 0603, 600Ω @ 100MHz, 0.38Ω, 25%, 500mA; Current Rating: 200mA; Impedance: 600R; Number of Lines: 1; DC Resistance (DCR): 380mR; Shielding: Unshielded; Material: Steel; Case Code (Metric): 1608; Radiation Hardening: No; Mount: Surface Mount; Series: EMIFIL®, BLM18A; Package Quantity: 4000; Length: 1.6mm; Depth: 0.8mm; Max Operating Temperature: 125°C; RoHS Compliant: Yes; Case/Package: 0603; Max DC Current: 200mA; Lead Free: Lead Free; Min Operating Temperature: -55°C; Packaging: Tape and Reel; Case Code (Imperial): 0603; Test Frequency: 100MHz; Termination: Flat; Number of Circuits: 1; Height: 0.8mm; Tolerance: 25%; Max Current Rating: 500mA; Contact Plating: Tin; Width: 0.8mm; Ratings: AEC-Q200
IC9 = STM32L431CBT6: Integrated Circuit; Manufacturer_Name: STMicroelectronics; Datasheet Link: https://www.st.com/resource/en/datasheet/stm32l431cb.pdf; Height: 1.6mm; Manufacturer_Part_Number: STM32L431CBT6; Mouser Part Number: 511-STM32L431CBT6; Mouser Price/Stock: https://www.mouser.co.uk/ProductDetail/STMicroelectronics/STM32L431CBT6?qs=U58vgkJzipQlQfAJeHTS0w%3D%3D; Arrow Part Number: STM32L431CBT6; Arrow Price/Stock: https://www.arrow.com/en/products/stm32l431cbt6/stmicroelectronics?utm_currency=USD&region=nac
LED3 = 150060VS83000: LED; Manufacturer_Name: Wurth Elektronik; Datasheet Link: https://www.we-online.com/catalog/datasheet/150060SV83000.pdf; Height: 1.15mm; Manufacturer_Part_Number: 150060VS83000
R30-R32 = CMP-001-0003-18: as R1 on sheet Fuel Gauge; Package: tbd
Y1 = CMP-27762-004085-1: CRYSTAL 8.0000MHZ 18PF SMD

## Sheet CAN.SchDoc
size A4; SheetNumber: 9; SheetTotal: 10
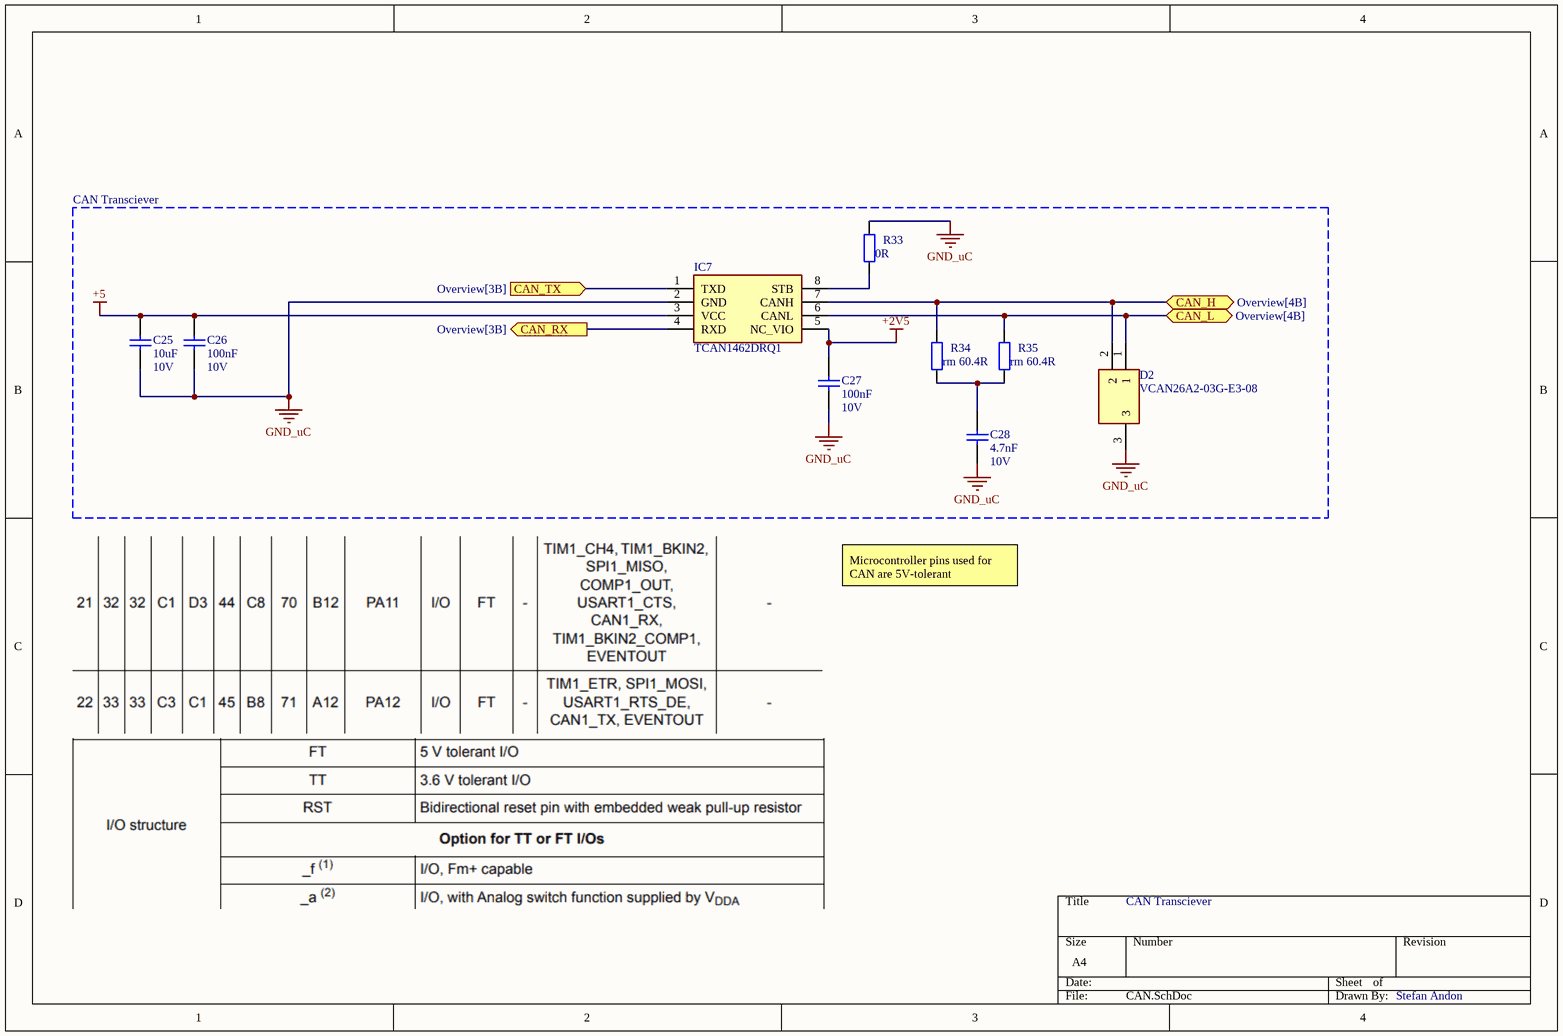
[diagram p5: CAN.SchDoc]

### Parts
C25  value 10uF  Voltage: 10V  [CAP_0603]  (hidden comment: Capacitor_SMD)
C26  value 100nF  Voltage: 10V  [CAP_0603]  (hidden comment: Capacitor_SMD)
C27  value 100nF  Voltage: 10V  [CAP_0603]  (hidden comment: Capacitor_SMD)
C28  value 4.7nF  Voltage: 10V  [CAP_0603]  (hidden comment: Capacitor_SMD)
D2  VCAN26A2-03G-E3-08  [SOT65P230X110-3N]
IC7  TCAN1462DRQ1  [SOIC127P600X175-8N]
R33  value 0R  [RES_0603]  (hidden comment: Resistor_SMD)
R34  value rm 60.4R  [RES_0603]  (hidden comment: Resistor_SMD)
R35  value rm 60.4R  [RES_0603]  (hidden comment: Resistor_SMD)

### Blocks framed on the sheet
CAN Transciever: C25-C28 D2 IC7 R33-R35

### Ports
CAN_H (bidir, see Overview[4B]), CAN_L (bidir, see Overview[4B]), CAN_RX (out, see Overview[3B]), CAN_TX (in, see Overview[3B])

### Nets
+2V5: C27.1 IC7.5(NC_VIO)
+5: C25.1 C26.1 IC7.3(VCC)
GND_uC: C25.2 C26.2 C27.2 C28.2 D2.3 IC7.2(GND) R33.1
CAN-H: D2.2 IC7.7(CANH) R34.1 ; port CAN_H
CAN-L: D2.1 IC7.6(CANL) R35.1 ; port CAN_L
NetC28_1: C28.1 R34.2 R35.2
NetIC7_1: IC7.1(TXD) ; port CAN_TX
NetIC7_4: IC7.4(RXD) ; port CAN_RX
NetIC7_8: IC7.8(STB) R33.2

### Notes on the sheet
- Microcontroller pins used for CAN are 5V-tolerant
- CAN Transciever
- Stefan Andon

### Library data of the parts
C25 = CMP-001-0004-13: as C20 on sheet STM32; Dielectric: tbd; Package: tbd
C26 C27 = CMP-001-0004-13: as C8 on sheet Buck Converter; Dielectric: tbd; Package: tbd
C28 = CMP-001-0004-13: SMD Capacitor; Tolerance: tbd; BOM: 4.7nF, 10V, tbd, tbd,CAP_0603; Dielectric: tbd; Package: tbd
D2 = VCAN26A2-03G-E3-08: TVS Diode (Bi-directional); Manufacturer_Name: Vishay; Datasheet Link: https://www.vishay.com/docs/85894/vcan26a2-03g.pdf; Height: 1.1mm; Manufacturer_Part_Number: VCAN26A2-03G-E3-08; Mouser Part Number: 78-VCAN26A2-03G-E308; Mouser Price/Stock: https://www.mouser.co.uk/ProductDetail/Vishay-General-Semiconductor/VCAN26A2-03G-E3-08?qs=53vSufdqhLqU7%252BocFt%252Bylg%3D%3D; Arrow Part Number: VCAN26A2-03G-E3-08; Arrow Price/Stock: https://www.arrow.com/en/products/vcan26a2-03g-e3-08/vishay?utm_currency=USD&region=nac
IC7 = TCAN1462DRQ1: Integrated Circuit; Manufacturer_Name: Texas Instruments; Datasheet Link: https://www.ti.com/lit/ds/symlink/tcan1462v-q1.pdf?ts=1700901504635; Height: 1.75mm; Manufacturer_Part_Number: TCAN1462DRQ1; Mouser Part Number: 595-TCAN1462DRQ1; Mouser Price/Stock: https://www.mouser.co.uk/ProductDetail/Texas-Instruments/TCAN1462DRQ1?qs=Jm2GQyTW%2Fbh7aeYIcsA55A%3D%3D; Arrow Part Number: TCAN1462DRQ1; Arrow Price/Stock: https://www.arrow.com/en/products/tcan1462drq1/texas-instruments?region=nac
R33-R35 = CMP-001-0003-18: as R1 on sheet Fuel Gauge; Package: tbd

## Sheet UART to USB.SchDoc
size A4; SheetNumber: 3; SheetTotal: 10
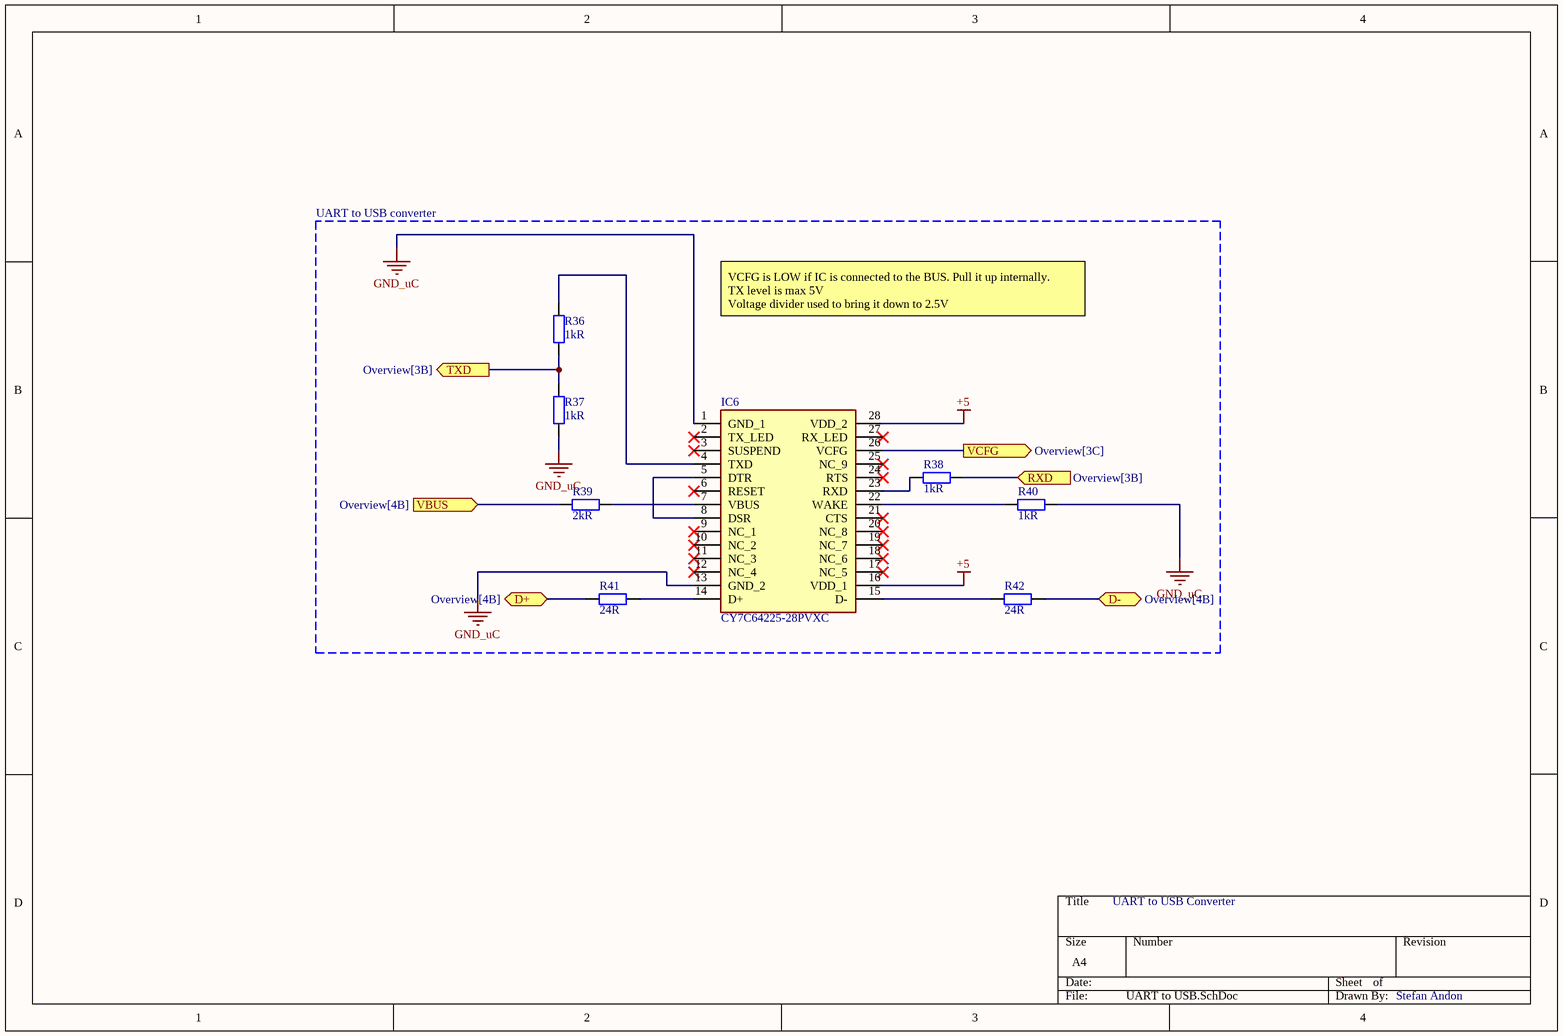
[diagram p6: UART to USB.SchDoc]

### Parts
IC6  CY7C64225-28PVXC  [SOP65P780X200-28N]
R36  value 1kR  [RES_0603]  (hidden comment: Resistor_SMD)
R37  value 1kR  [RES_0603]  (hidden comment: Resistor_SMD)
R38  value 1kR  [RES_0603]  (hidden comment: Resistor_SMD)
R39  value 2kR  [RES_0603]  (hidden comment: Resistor_SMD)
R40  value 1kR  [RES_0603]  (hidden comment: Resistor_SMD)
R41  value 24R  [RES_0603]  (hidden comment: Resistor_SMD)
R42  value 24R  [RES_0603]  (hidden comment: Resistor_SMD)

### Blocks framed on the sheet
UART to USB converter: IC6 R36-R42

### Ports
D+ (bidir, see Overview[4B]), D- (bidir, see Overview[4B]), RXD (in, see Overview[3B]), TXD (out, see Overview[3B]), VBUS (in, see Overview[4B]), VCFG (out, see Overview[3C])

### Nets
+5: IC6.16(VDD_1) IC6.28(VDD_2)
GND_uC: IC6.1(GND_1) IC6.13(GND_2) R37.1 R40.2
D+: R41.1 ; port D+
D-: R42.2 ; port D-
NetIC6_4: IC6.4(TXD) R36.2
NetIC6_5: IC6.5(DTR) IC6.8(DSR)
NetIC6_7: IC6.7(VBUS) R39.2
NetIC6_14: IC6.14(D+) R41.2
NetIC6_15: IC6.15(D-) R42.1
NetIC6_22: IC6.22(WAKE) R40.1
NetIC6_23: IC6.23(RXD) R38.2
NetIC6_26: IC6.26(VCFG) ; port VCFG
NetIC9_42: R38.1 ; port RXD
NetIC9_43: R36.1 R37.2 ; port TXD
NetJ6_A4: R39.1 ; port VBUS

Not connected (* = marked no-connect by the designer): IC6 2(TX_LED)* 3(SUSPEND)* 6(RESET)* 9(NC_1)* 10(NC_2)* 11(NC_3)* 12(NC_4)* 17(NC_5)* 18(NC_6)* 19(NC_7)* 20(NC_8)* 21(CTS)* 24(RTS)* 25(NC_9)* 27(RX_LED)*

### Notes on the sheet
- VCFG is LOW if IC is connected to the BUS. Pull it up internally.
  TX level is max 5V
  Voltage divider used to bring it down to 2.5V
- UART to USB Converter
- Stefan Andon

### Library data of the parts
IC6 = CY7C64225-28PVXC: Integrated Circuit; Manufacturer_Name: Infineon; Datasheet Link: http://www.cypress.com/file/139421/download; Height: 2mm; Manufacturer_Part_Number: CY7C64225-28PVXC; Mouser Part Number: 727-CY7C64225-28PVXC; Mouser Price/Stock: https://www.mouser.co.uk/ProductDetail/Cypress-Semiconductor/CY7C64225-28PVXC?qs=YrQxKq3BqGD638xSzFasMw%3D%3D; Arrow Part Number: CY7C64225-28PVXC; Arrow Price/Stock: https://www.arrow.com/en/products/cy7c64225-28pvxc/cypress-semiconductor?region=nac
R36-R42 = CMP-001-0003-18: as R1 on sheet Fuel Gauge; Package: tbd

## Sheet JTAG.SchDoc
size A4; SheetNumber: 5; SheetTotal: 10
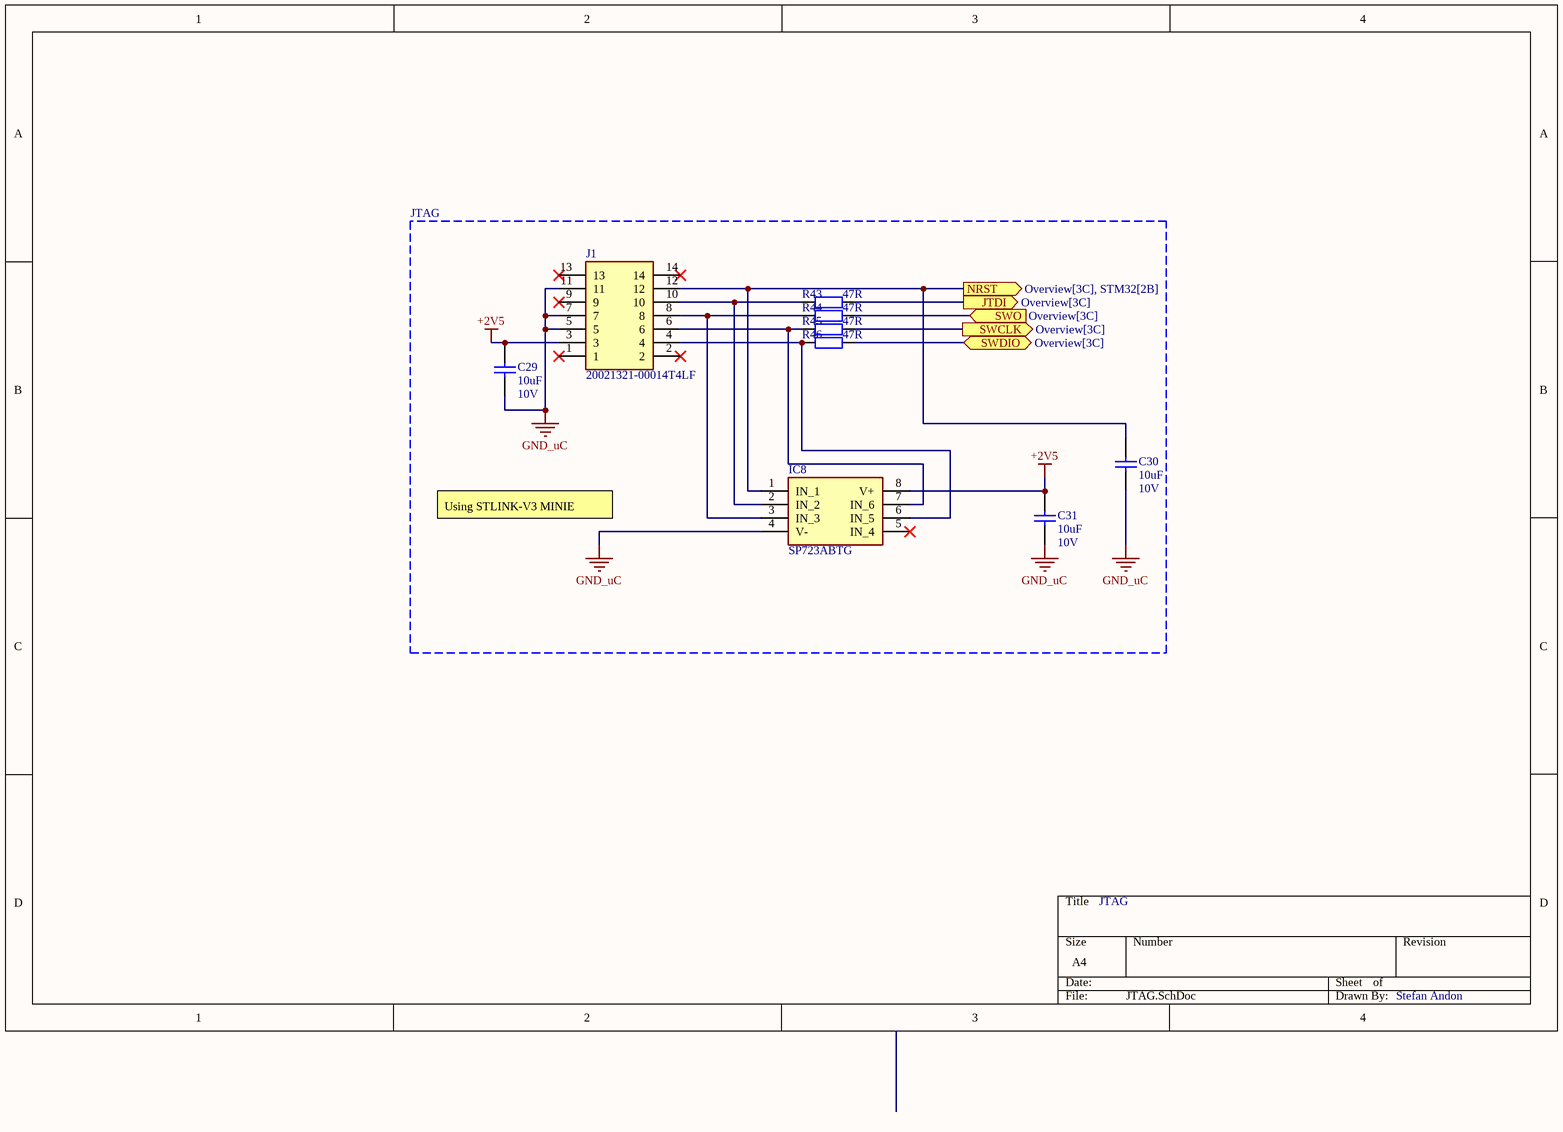
[diagram p7: JTAG.SchDoc]

### Parts
C29  value 10uF  Voltage: 10V  [CAP_0603]  (hidden comment: Capacitor_SMD)
C30  value 10uF  Voltage: 10V  [CAP_0603]  (hidden comment: Capacitor_SMD)
C31  value 10uF  Voltage: 10V  [CAP_0603]  (hidden comment: Capacitor_SMD)
IC8  SP723ABTG  [SOIC127P600X175-8N]
J1  20021321-00014T4LF  [2002132100014T4LF]
R43  value 47R  [RES_0603]  (hidden comment: Resistor_SMD)
R44  value 47R  [RES_0603]  (hidden comment: Resistor_SMD)
R45  value 47R  [RES_0603]  (hidden comment: Resistor_SMD)
R46  value 47R  [RES_0603]  (hidden comment: Resistor_SMD)

### Blocks framed on the sheet
JTAG: C29-C31 IC8 J1 R43-R46

### Ports
JTDI (out, see Overview[3C]), NRST (out, see Overview[3C], STM32[2B]), SWCLK (out, see Overview[3C]), SWDIO (bidir, see Overview[3C]), SWO (in, see Overview[3C])

### Nets
+2V5: C29.1 C31.1 IC8.8(V+) J1.3
GND_uC: C29.2 C30.2 C31.2 IC8.4(V-) J1.5 J1.7 J1.11
NetC30_1: C30.1 IC8.1(IN_1) J1.12 ; port NRST
NetIC8_2: IC8.2(IN_2) J1.10 R43.2
NetIC8_3: IC8.3(IN_3) J1.8 R44.2
NetIC8_6: IC8.6(IN_5) J1.4 R46.2
NetIC8_7: IC8.7(IN_6) J1.6 R45.2
NetIC9_34: R46.1 ; port SWDIO
NetIC9_37: R45.1 ; port SWCLK
NetIC9_38: R43.1 ; port JTDI
NetIC9_39: R44.1 ; port SWO

Not connected (* = marked no-connect by the designer): IC8 5(IN_4)*; J1 1* 2* 9* 13* 14*

### Notes on the sheet
- Using STLINK-V3 MINIE
- JTAG
- Stefan Andon

### Library data of the parts
C29-C31 = CMP-001-0004-13: as C20 on sheet STM32; Dielectric: tbd; Package: tbd
IC8 = SP723ABTG: Integrated Circuit; Manufacturer_Name: LITTELFUSE; Datasheet Link: https://www.littelfuse.com/~/media/electronics/datasheets/tvs_diode_arrays/littelfuse_tvs_diode_array_sp723_datasheet.pdf.pdf; Height: 1.75mm; Manufacturer_Part_Number: SP723ABTG; Mouser Part Number: 576-SP723ABTG; Mouser Price/Stock: https://www.mouser.co.uk/ProductDetail/Littelfuse/SP723ABTG?qs=RnOBYWd%2Fz7ekbxzWCa4D1g%3D%3D; Arrow Part Number: SP723ABTG; Arrow Price/Stock: https://www.arrow.com/en/products/sp723abtg/littelfuse?region=nac
J1 = 20021321-00014T4LF: Connector; Manufacturer_Name: Amphenol; Datasheet Link: https://cdn.amphenol-cs.com/media/wysiwyg/files/drawing/20021321.pdf; Height: 4.65mm; Manufacturer_Part_Number: 20021321-00014T4LF; Mouser Part Number: 649-221321-00014T4LF; Mouser Price/Stock: https://www.mouser.co.uk/ProductDetail/Amphenol-FCI/20021321-00014T4LF?qs=oJs1R%252BxK6kRZfo0i005jmw%3D%3D
R43-R46 = CMP-001-0003-18: as R1 on sheet Fuel Gauge; Package: tbd

## Sheet Power_Connectors.SchDoc
size A4; SheetNumber: 2; SheetTotal: 10
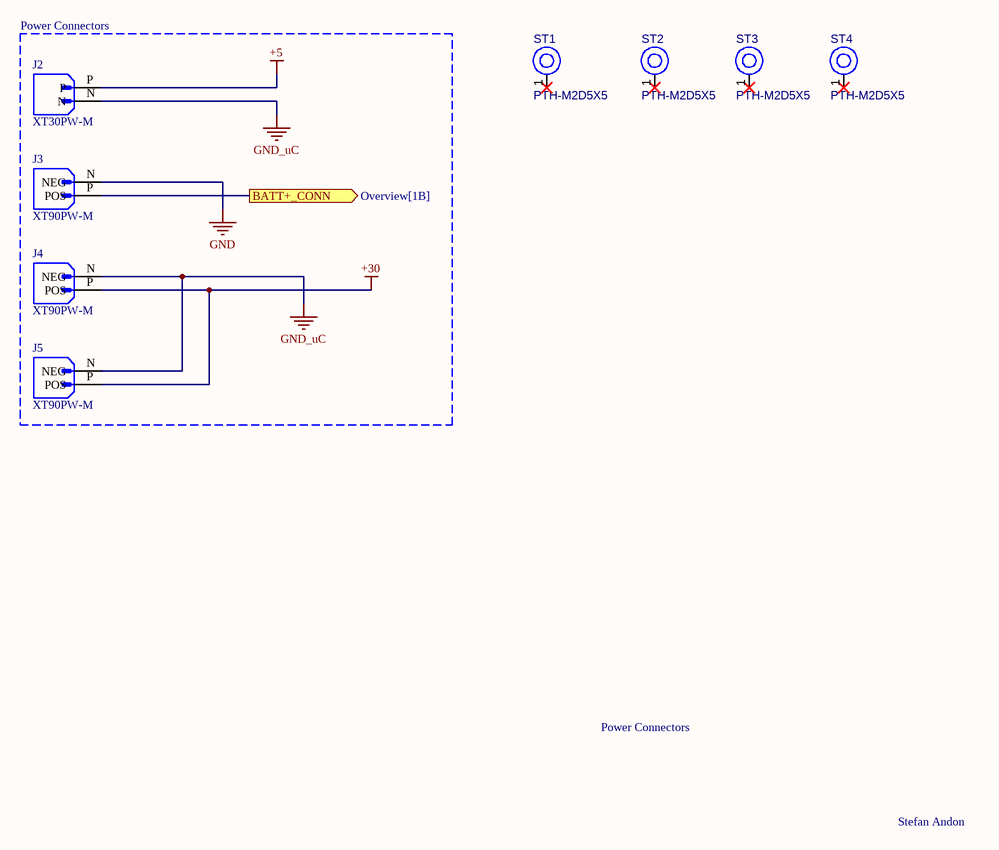
[diagram p8: Power_Connectors.SchDoc]

### Parts
J2  XT30PW-M  [AMASS_XT30PW-M]
J3  XT90PW-M  [AMASS_XT90PW-M]
J4  XT90PW-M  [AMASS_XT90PW-M]
J5  XT90PW-M  [AMASS_XT90PW-M]
ST1  PTH-M2D5X5  [PTH-M2D5X5]
ST2  PTH-M2D5X5  [PTH-M2D5X5]
ST3  PTH-M2D5X5  [PTH-M2D5X5]
ST4  PTH-M2D5X5  [PTH-M2D5X5]

### Blocks framed on the sheet
Power Connectors: J2-J5

### Ports
BATT+_CONN (out, see Overview[1B])

### Nets
+5: J2.P
+30: J4.P(POS) J5.P(POS)
GND: J3.N(NEG)
GND_uC: J2.N J4.N(NEG) J5.N(NEG)
VIN: J3.P(POS) ; port BATT+_CONN

Not connected (* = marked no-connect by the designer): ST1 1(H1)*; ST2 1(H1)*; ST3 1(H1)*; ST4 1(H1)*

### Notes on the sheet
- Power Connectors
- Stefan Andon

### Library data of the parts
J2 = CMP-002-00071-1: Socket; DC supply; XT30; male; PIN: 2; on PCBs; THT; Colour: yellow; MF: AMASS; Source: XT30PW-M.SchLib; MP: XT30PW-M; Check_prices: https://www.snapeda.com/parts/XT30PW-M/AMASS/view-part/?ref=eda; Case/Package: None; Pins: 2; Component Type: Standard; Value: *; Design Item ID: XT30PW-M; SnapEDA_Link: https://www.snapeda.com/parts/XT30PW-M/AMASS/view-part/?ref=snap
J3-J5 = CMP-002-00072-1: Socket; DC supply; XT90; male; PIN: 2; on PCBs; THT; Colour: yellow; MF: AMASS; Check_prices: https://www.snapeda.com/parts/XT90PW-M/AMASS/view-part/?ref=eda; MP: XT90PW-M; Case/Package: Package; Pins: 2; SnapEDA_Link: https://www.snapeda.com/parts/XT90PW-M/AMASS/view-part/?ref=snap; Value: *; Source: XT90PW-M.SchLib; Design Item ID: XT90PW-M; Component Type: Standard
ST1-ST4 = CMP-00028-00004-2: M2 PTH (2.5mm), 5mm pad; Pins: 1

## Sheet Signal_Connectors.SchDoc
size A4; SheetNumber: 10; SheetTotal: 10
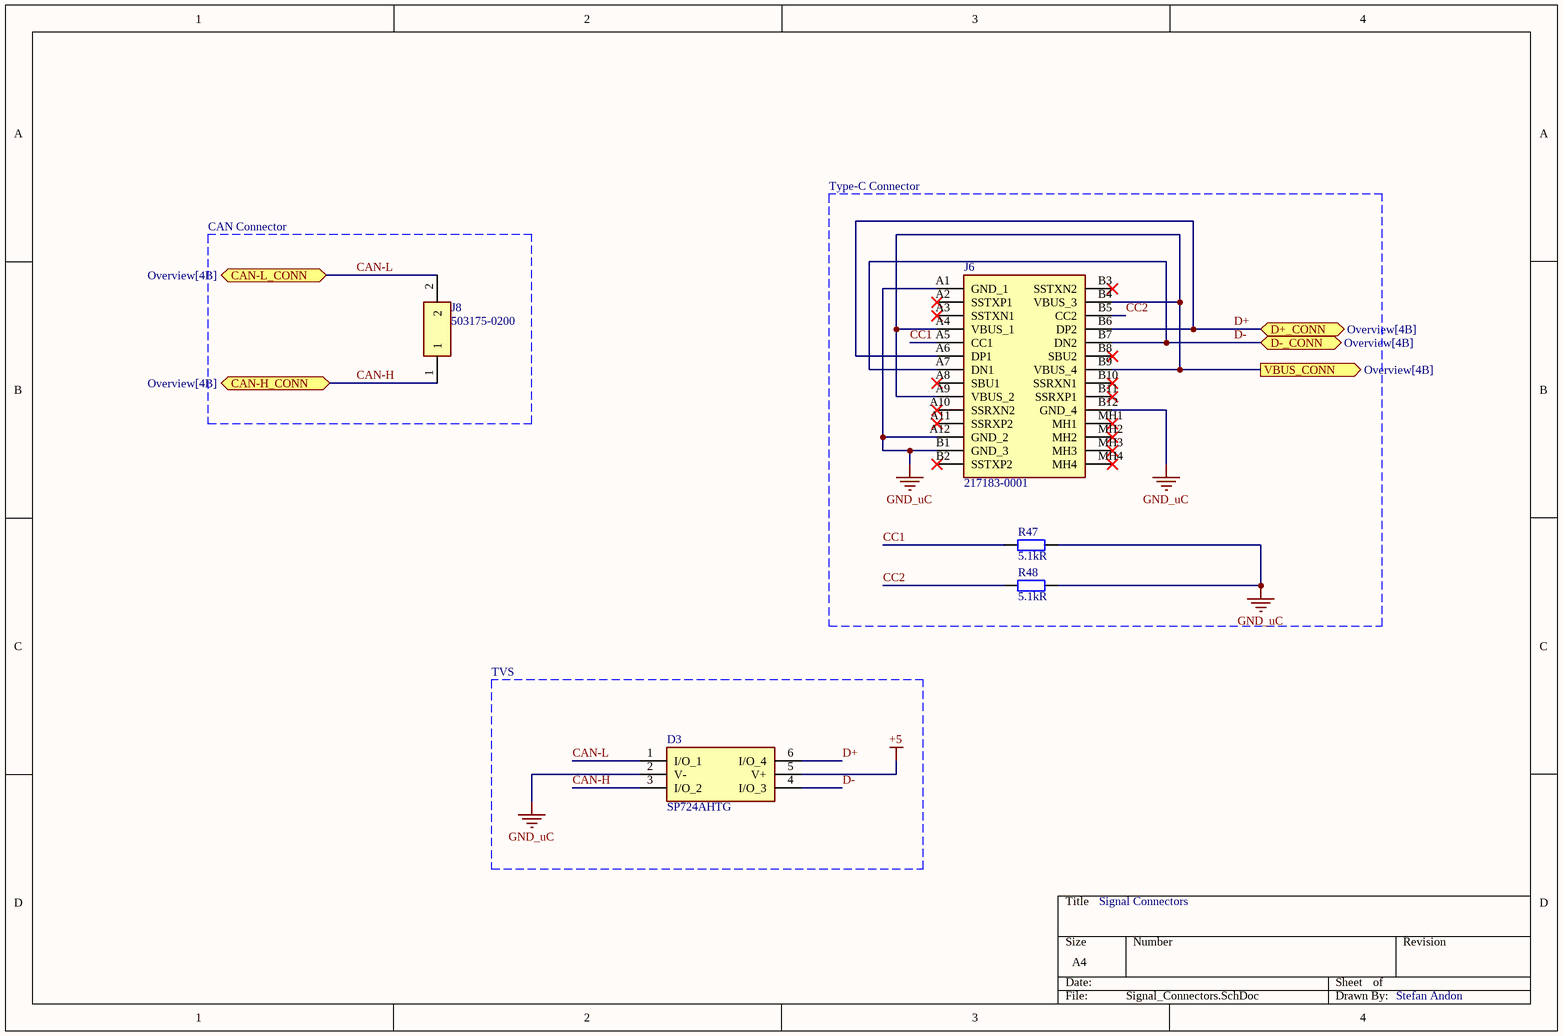
[diagram p9: Signal_Connectors.SchDoc]

### Parts
D3  SP724AHTG  [SOT95P280X145-6N]
J6  217183-0001  [2171830001]
J8  503175-0200  [5031750200]
R47  value 5.1kR  [RES_0603]  (hidden comment: Resistor_SMD)
R48  value 5.1kR  [RES_0603]  (hidden comment: Resistor_SMD)

### Blocks framed on the sheet
Type-C Connector: J6 R47 R48
CAN Connector: J8
TVS: D3

### Ports
CAN-H_CONN (bidir, see Overview[4B]), CAN-L_CONN (bidir, see Overview[4B]), D+_CONN (bidir, see Overview[4B]), D-_CONN (bidir, see Overview[4B]), VBUS_CONN (out, see Overview[4B])

### Nets
+5: D3.5(V+)
GND_uC: D3.2(V-) J6.A1(GND_1) J6.A12(GND_2) J6.B1(GND_3) J6.B12(GND_4) R47.1 R48.1
CAN-H: D3.3(I/O_2) J8.1 ; port CAN-H_CONN
CAN-L: D3.1(I/O_1) J8.2 ; port CAN-L_CONN
CC1: J6.A5(CC1) R47.2
CC2: J6.B5(CC2) R48.2
D+: D3.6(I/O_4) J6.A6(DP1) J6.B6(DP2) ; port D+_CONN
D-: D3.4(I/O_3) J6.A7(DN1) J6.B7(DN2) ; port D-_CONN
NetJ6_A4: J6.A4(VBUS_1) J6.A9(VBUS_2) J6.B4(VBUS_3) J6.B9(VBUS_4) ; port VBUS_CONN

Not connected (* = marked no-connect by the designer): J6 A2(SSTXP1)* A3(SSTXN1)* A8(SBU1)* A10(SSRXN2)* A11(SSRXP2)* B2(SSTXP2)* B3(SSTXN2)* B8(SBU2)* B10(SSRXN1)* B11(SSRXP1)* MH1* MH2* MH3* MH4*

### Notes on the sheet
- Signal Connectors
- Stefan Andon

### Library data of the parts
D3 = SP724AHTG: TVS Diode (Bi-directional); Manufacturer_Name: LITTELFUSE; Datasheet Link: https://www.littelfuse.com/~/media/electronics/datasheets/tvs_diode_arrays/littelfuse_tvs_diode_array_sp724_datasheet.pdf.pdf; Height: 1.45mm; Manufacturer_Part_Number: SP724AHTG; Mouser Part Number: 576-SP724AHTG; Mouser Price/Stock: https://www.mouser.co.uk/ProductDetail/Littelfuse/SP724AHTG?qs=FuFbM%252B3iO0xmrFuCe7QggQ%3D%3D
J6 = 217183-0001: Connector; Manufacturer_Name: Molex; Datasheet Link: https://www.molex.com/pdm_docs/sd/2171830001_sd.pdf; Height: 3.36mm; Manufacturer_Part_Number: 217183-0001; Mouser Part Number: 538-217183-0001; Mouser Price/Stock: https://www.mouser.co.uk/ProductDetail/Molex/217183-0001?qs=DRkmTr78QAQVjf9fqpgsow%3D%3D
J8 = 503175-0200: Connector; Manufacturer_Name: Molex; Height: 7.15mm; Manufacturer_Part_Number: 503175-0200; Mouser Part Number: 538-503175-0200; Mouser Price/Stock: https://www.mouser.co.uk/ProductDetail/Molex/503175-0200?qs=3OKVfsn1b5Bt3iMCrTKlBA%3D%3D
R47 R48 = CMP-001-0003-18: as R1 on sheet Fuel Gauge; Package: tbd

## Nets that join several sheets
+2V5: Fuel Gauge (C3.2 IC1.5), Buck Converter (C11.2 L2.2 R21.1), STM32 (9 pins), CAN (C27.1 IC7.5), JTAG (C29.1 C31.1 IC8.8 J1.3)
+5: Buck Converter (C10.2 L1.2 R20.1), CAN (C25.1 C26.1 IC7.3), UART to USB (IC6.16 IC6.28), Power_Connectors (J2.P), Signal_Connectors (D3.5)
+30: Fuel Gauge (Q2.3 Q3.3 R1.1 R6.1), Buck Converter (6 pins), Input Protection (IC5.8 R24.2), Power_Connectors (J4.P J5.P)
GND: Fuel Gauge (14 pins), Input Protection (5 pins), Power_Connectors (J3.N)
GND_uC: Fuel Gauge (C3.1 IC1.2 R15.1 R16.2), Buck Converter (12 pins), STM32 (15 pins), CAN (7 pins), UART to USB (IC6.1 IC6.13 R37.1 R40.2), JTAG (7 pins), Power_Connectors (J2.N J4.N J5.N), Signal_Connectors (7 pins)
ALERT: Fuel Gauge (IC2.1 Q4.1), STM32 (IC9.19)
CAN-H: CAN (D2.2 IC7.7 R34.1), Signal_Connectors (D3.3 J8.1)
CAN-L: CAN (D2.1 IC7.6 R35.1), Signal_Connectors (D3.1 J8.2)
D+: UART to USB (R41.1), Signal_Connectors (D3.6 J6.A6 J6.B6)
D-: UART to USB (R42.2), Signal_Connectors (D3.4 J6.A7 J6.B7)
NetC30_1: STM32 (IC9.7), JTAG (C30.1 IC8.1 J1.12)
NetIC1_1: Fuel Gauge (IC1.1), STM32 (IC9.17)
NetIC1_3: Fuel Gauge (IC1.3), STM32 (IC9.16)
NetIC6_26: STM32 (IC9.41), UART to USB (IC6.26)
NetIC7_1: STM32 (IC9.32), CAN (IC7.1)
NetIC7_4: STM32 (IC9.33), CAN (IC7.4)
NetIC9_30: Fuel Gauge (R14.1), STM32 (IC9.30)
NetIC9_31: Fuel Gauge (R12.1), STM32 (IC9.31)
NetIC9_34: STM32 (IC9.34), JTAG (R46.1)
NetIC9_37: STM32 (IC9.37), JTAG (R45.1)
NetIC9_38: STM32 (IC9.38), JTAG (R43.1)
NetIC9_39: STM32 (IC9.39), JTAG (R44.1)
NetIC9_42: STM32 (IC9.42), UART to USB (R38.1)
NetIC9_43: STM32 (IC9.43), UART to USB (R36.1 R37.2)
NetJ6_A4: UART to USB (R39.1), Signal_Connectors (J6.A4 J6.A9 J6.B4 J6.B9)
PG1: Buck Converter (IC3.7), STM32 (IC9.14)
STATE: Fuel Gauge (IC2.3 Q5.1), STM32 (IC9.18)
VIN: Input Protection (8 pins), Power_Connectors (J3.P)